# EAGLE design minicommand-sram (EAGLE 5.06)

## Sheet 1 of 5
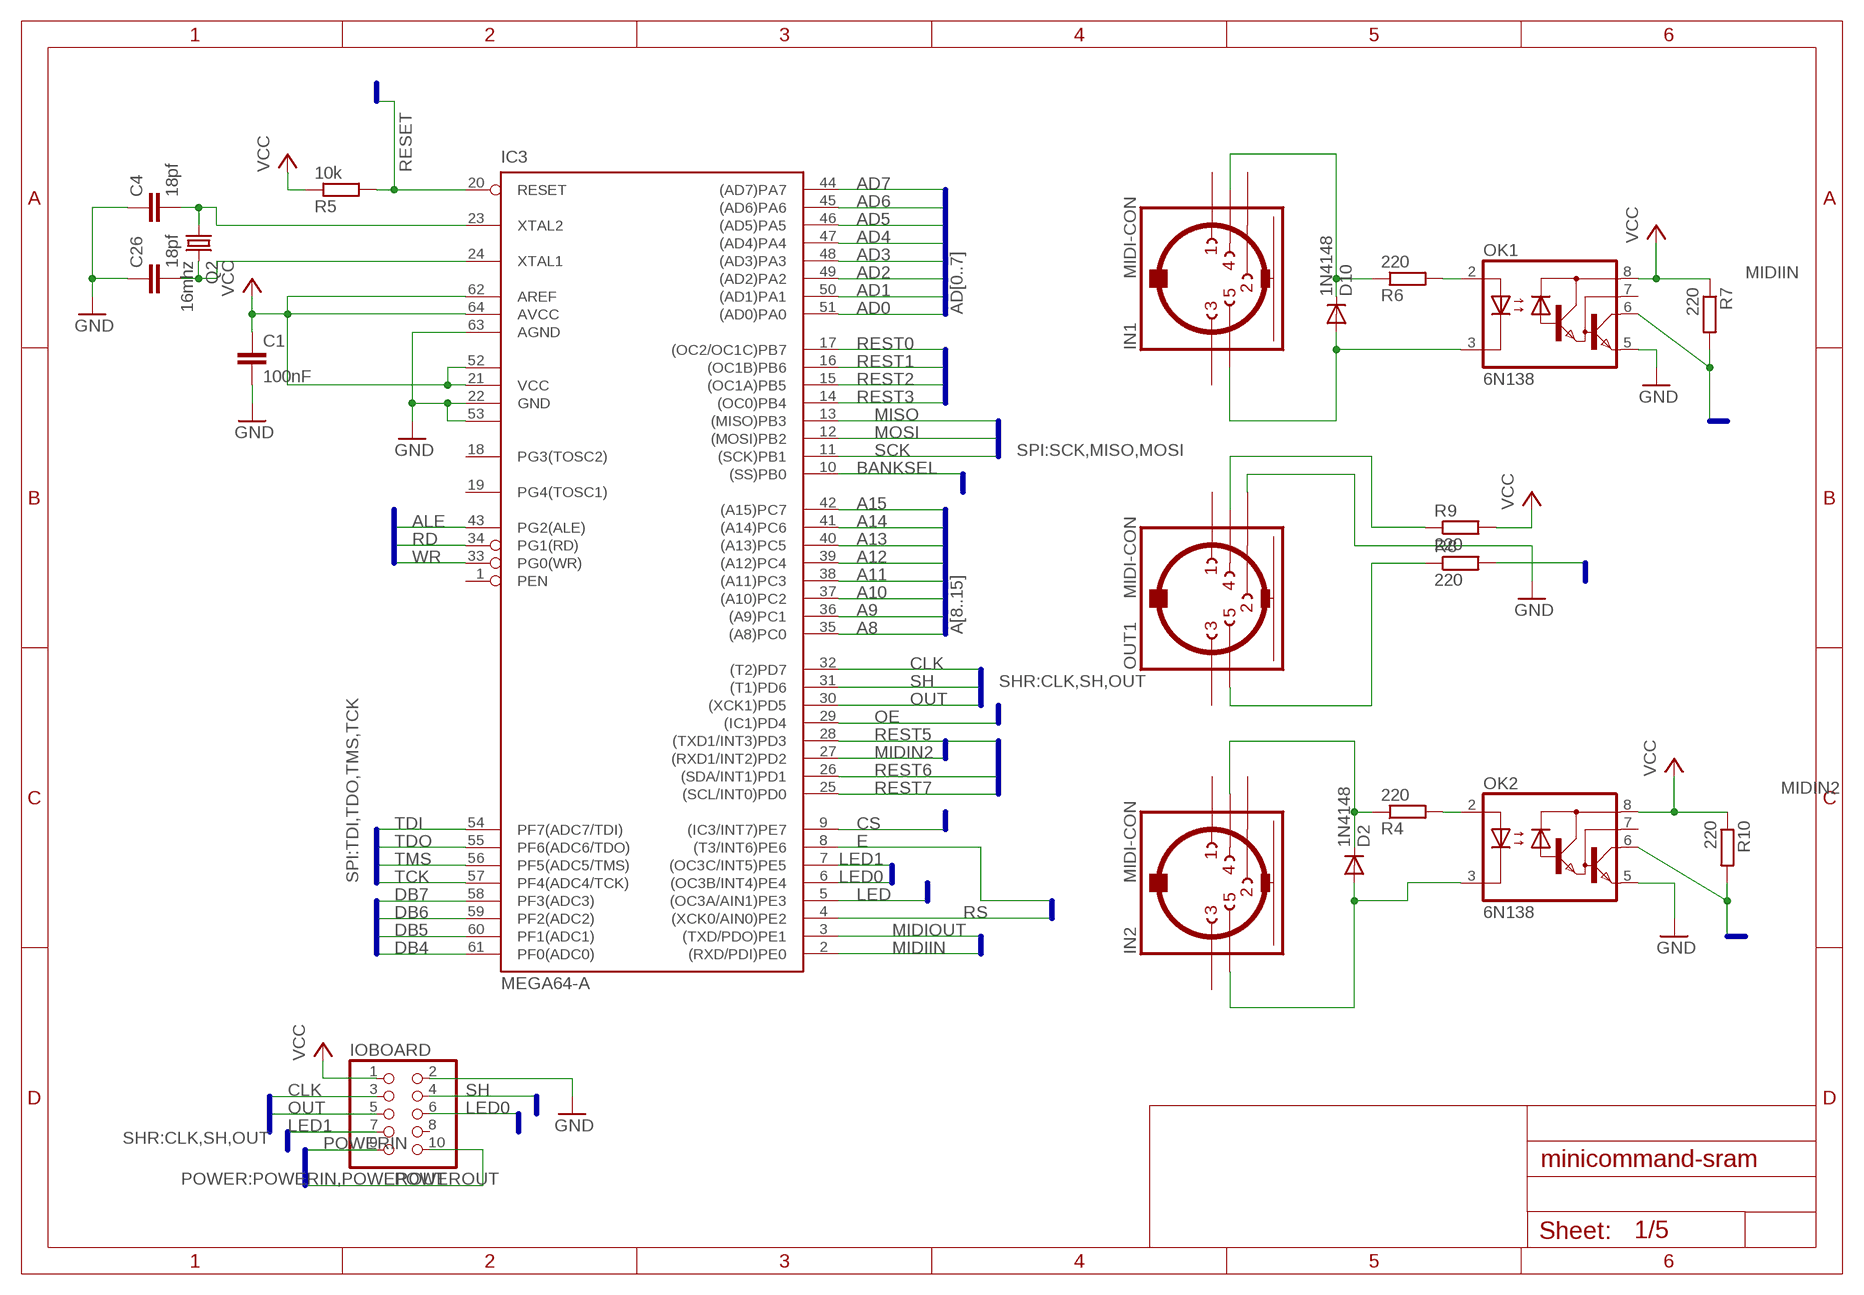
[diagram p0: schematic, sheet 1]

### Parts
C1  100nF  C-EUC0805  [C0805]
C4  18pf  C-EUC0805  [C0805]
C26  18pf  C-EUC0805  [C0805]
D2  1N4148  [DO35-10]
D10  1N4148  [DO35-10]
IC3  MEGA64-A  [TQFP64]
IN1  MIDI-CON  [MAB5S]
IN2  MIDI-CON  [MAB5S]
IOBOARD  PINHD-2X5  [2X05]
OK1  6N138  [DIL08]
OK2  6N138  [DIL08]
OUT1  MIDI-CON  [MAB5S]
Q2  16mhz  CRYSTALHC18U-V  [HC18U-V]
R4  220  R-EU_R0805  [R0805]
R5  10k  R-EU_R0805  [R0805]
R6  220  R-EU_R0805  [R0805]
R7  220  R-EU_R0805  [R0805]
R8  220  R-EU_R0805  [R0805]
R9  220  R-EU_R0805  [R0805]
R10  220  R-EU_R0805  [R0805]

### Nets
A8: IC3.35((A8)PC0) ; also sheet 4
A9: IC3.36((A9)PC1) ; also sheet 4
A10: IC3.37((A10)PC2) ; also sheet 4
A11: IC3.38((A11)PC3) ; also sheet 4
A12: IC3.39((A12)PC4) ; also sheet 4
A13: IC3.40((A13)PC5) ; also sheet 4
A14: IC3.41((A14)PC6) ; also sheet 4
A15: IC3.42((A15)PC7) ; also sheet 4
AD0: IC3.51((AD0)PA0) ; also sheet 4
AD1: IC3.50((AD1)PA1) ; also sheet 4
AD2: IC3.49((AD2)PA2) ; also sheet 4
AD3: IC3.48((AD3)PA3) ; also sheet 4
AD4: IC3.47((AD4)PA4) ; also sheet 4
AD5: IC3.46((AD5)PA5) ; also sheet 4
AD6: IC3.45((AD6)PA6) ; also sheet 4
AD7: IC3.44((AD7)PA7) ; also sheet 4
ALE: IC3.43(PG2(ALE)) ; also sheet 4
BANKSEL: IC3.10((SS)PB0) ; also sheet 4
CLK: IC3.32((T2)PD7) IOBOARD.3
CS: IC3.9((IC3/INT7)PE7) ; also sheet 5
DB4: IC3.61(PF0(ADC0)) ; also sheet 3
DB5: IC3.60(PF1(ADC1)) ; also sheet 3
DB6: IC3.59(PF2(ADC2)) ; also sheet 3
DB7: IC3.58(PF3(ADC3)) ; also sheet 3
E: IC3.8((T3/INT6)PE6) ; also sheet 3
GND: C1.2 C4.1 C26.1 IC3.22(GND) IC3.53(GND1) IC3.63(AGND) IOBOARD.2 OK1.5(GND) OK2.5(GND) OUT1.2 ; also sheet 2,3,4,5
LED: IC3.5((OC3A/AIN1)PE3) ; also sheet 3
LED0: IC3.6((OC3B/INT4)PE4) IOBOARD.6
LED1: IC3.7((OC3C/INT5)PE5) IOBOARD.7
MIDIIN: IC3.2((RXD/PDI)PE0) OK1.6(VO) R7.2
MIDIN2: IC3.27((RXD1/INT2)PD2) OK2.6(VO) R10.2
MIDIOUT: IC3.3((TXD/PDO)PE1) R8.2
MISO: IC3.13((MISO)PB3) ; also sheet 5
MOSI: IC3.12((MOSI)PB2) ; also sheet 5
N$1: D2.C IN2.4 R4.1
N$4: OK2.2(A) R4.2
N$6: D2.A IN2.5 OK2.3(C)
N$10: D10.C IN1.4 R6.1
N$11: OUT1.4 R9.1
N$12: OUT1.5 R8.1
N$13: OK1.2(A) R6.2
N$20: D10.A IN1.5 OK1.3(C)
N$27: C4.2 IC3.23(XTAL2) Q2.1
N$28: C26.2 IC3.24(XTAL1) Q2.2
OE: IC3.29((IC1)PD4) ; also sheet 5
OUT: IC3.30((XCK1)PD5) IOBOARD.5
POWERIN: IOBOARD.9 ; also sheet 2
POWEROUT: IOBOARD.10 ; also sheet 2
RD: IC3.34(PG1(RD)) ; also sheet 4
RESET: IC3.20(RESET) R5.2 ; also sheet 5
REST0: IC3.17((OC2/OC1C)PB7) ; also sheet 5
REST1: IC3.16((OC1B)PB6) ; also sheet 5
REST2: IC3.15((OC1A)PB5) ; also sheet 5
REST3: IC3.14((OC0)PB4) ; also sheet 5
REST5: IC3.28((TXD1/INT3)PD3) ; also sheet 5
REST6: IC3.26((SDA/INT1)PD1) ; also sheet 5
REST7: IC3.25((SCL/INT0)PD0) ; also sheet 5
RS: IC3.4((XCK0/AIN0)PE2) ; also sheet 3
SCK: IC3.11((SCK)PB1) ; also sheet 5
SH: IC3.31((T1)PD6) IOBOARD.4
TCK: IC3.57(PF4(ADC4/TCK)) ; also sheet 5
TDI: IC3.54(PF7(ADC7/TDI)) ; also sheet 5
TDO: IC3.55(PF6(ADC6/TDO)) ; also sheet 5
TMS: IC3.56(PF5(ADC5/TMS)) ; also sheet 5
VCC: C1.1 IC3.21(VCC) IC3.52(VCC1) IC3.62(AREF) IC3.64(AVCC) IOBOARD.1 OK1.8(VCC) OK2.8(VCC) R5.1 R7.1 R9.2 R10.1 ; also sheet 2,3,4,5
WR: IC3.33(PG0(WR)) ; also sheet 4
Unconnected: IC3.1(PEN) IC3.18(PG3(TOSC2)) IC3.19(PG4(TOSC1)) IN1.1 IN1.2 IN1.3 IN2.1 IN2.2 IN2.3 IOBOARD.8 OK1.7(VB) OK2.7(VB) OUT1.1 OUT1.3

### Buses
MIDIN2
SPI:SCK,MISO,MOSI
SHR:CLK,SH,OUT
LCD:RS,E,DB[0..7],LED
LED[0..1]
POWER:POWERIN,POWEROUT
MIDIIN,MIDIOUT
AD[0..7]
RAM:ALE,RD,WR
A[8..15]
SPI:TDI,TDO,TMS,TCK
RESET
BANKSEL
REST[0..7]
CS
OE

## Sheet 2 of 5
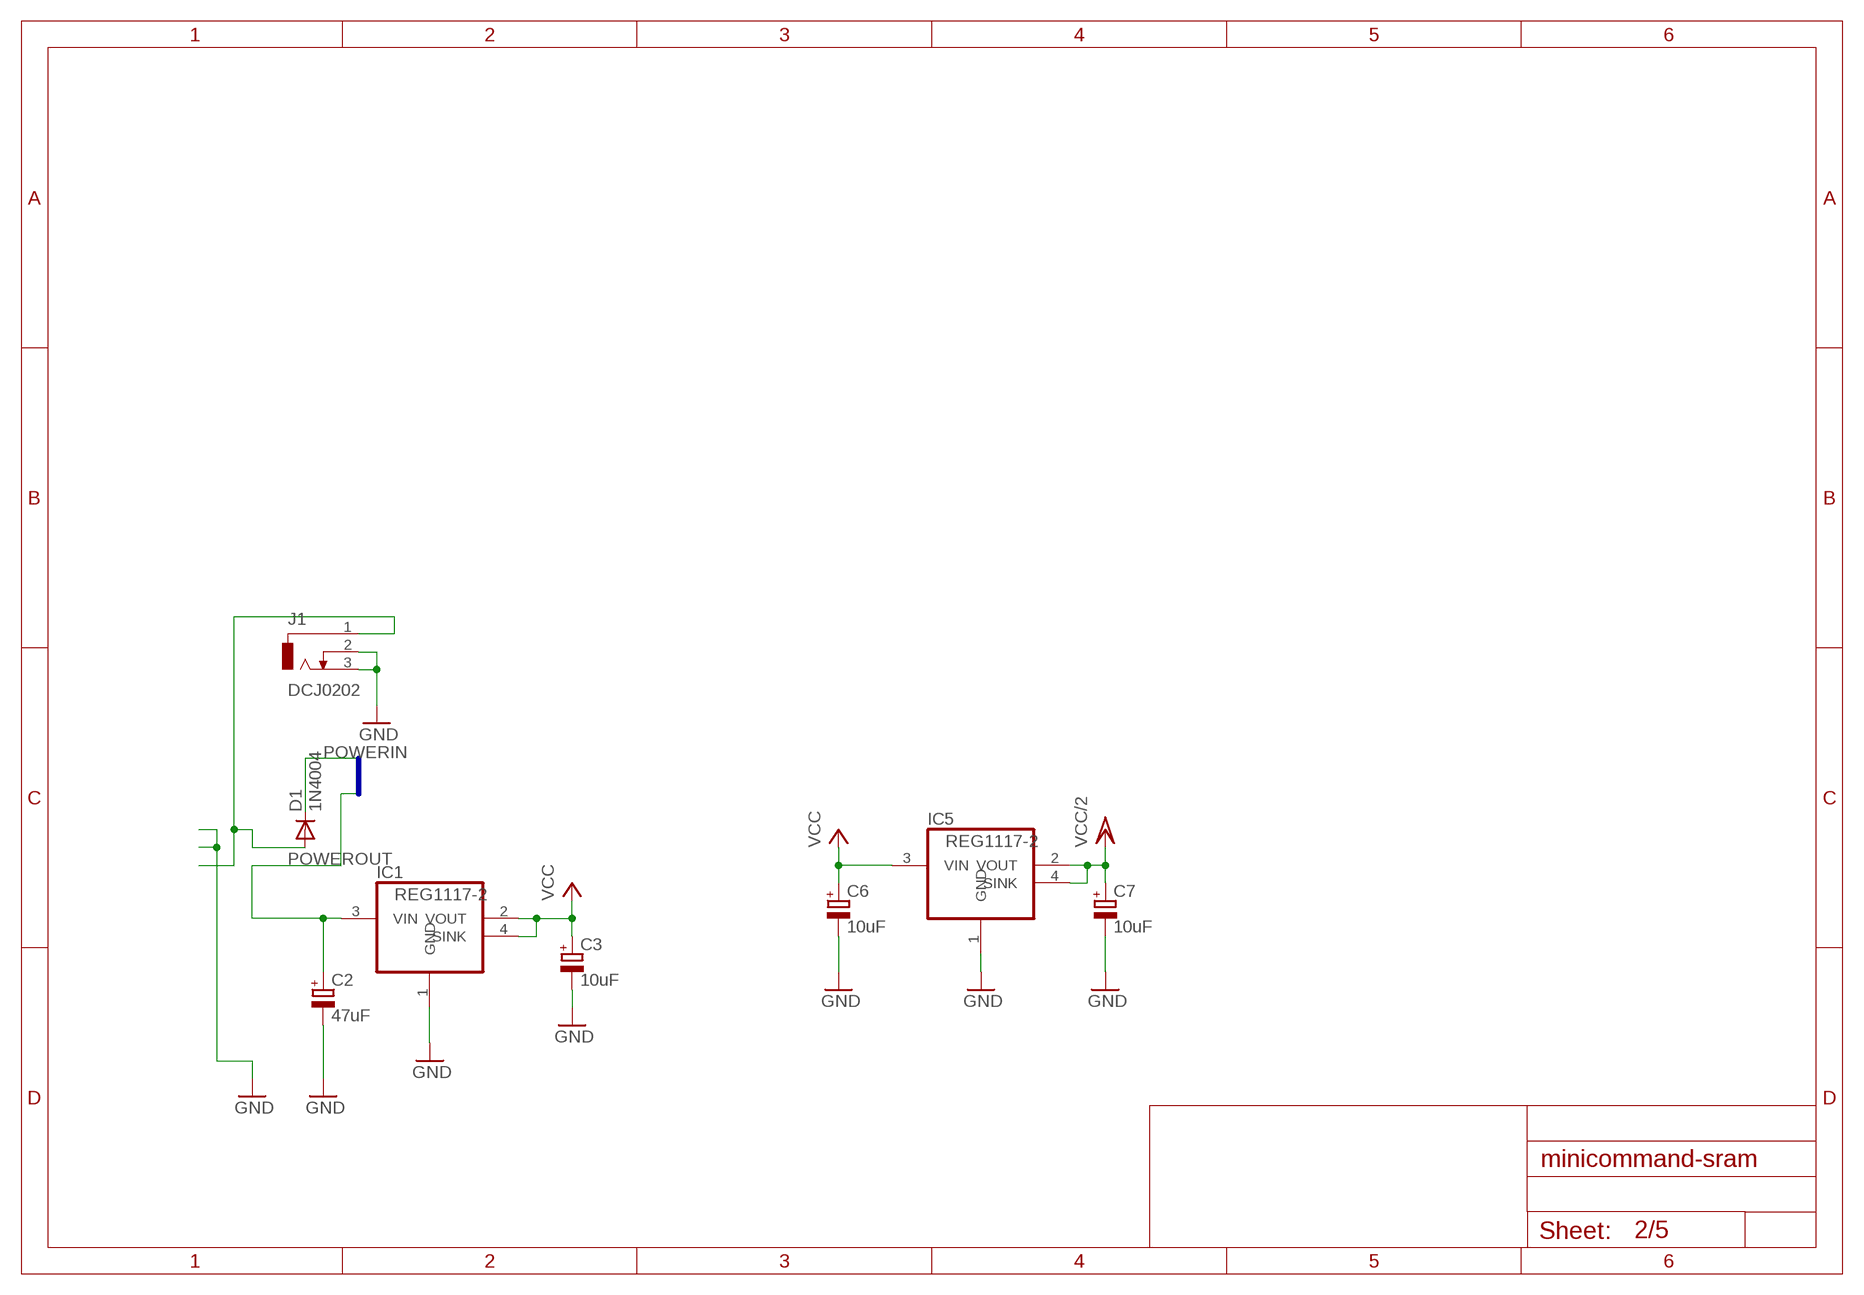
[diagram p1: schematic, sheet 2]

### Parts
C2  47uF  CPOL-EUUD-6,3X7,7  [UD-6,3X7,7_NICHICON]
C3  10uF  CPOL-EUUD-5X5,8  [UD-5X5,8_NICHICON]
C6  10uF  CPOL-EUUD-5X5,8  [UD-5X5,8_NICHICON]
C7  10uF  CPOL-EUUD-5X5,8  [UD-5X5,8_NICHICON]
D1  1N4004  [DO41-10]
IC1  REG1117-2  [SOT223]
IC5  REG1117-2  [SOT223]
J1  DCJ0202  [DCJ0202]

### Nets
GND: C2.- C3.- C6.- C7.- IC1.1(GND) IC5.1(GND) J1.2 J1.3 ; also sheet 1,3,4,5
N$9: D1.A J1.1
POWERIN: D1.C ; also sheet 1
POWEROUT: C2.+ IC1.3(VIN) ; also sheet 1
VCC: C3.+ C6.+ IC1.2(VOUT) IC1.4(SINK) IC5.3(VIN) ; also sheet 1,3,4,5
VCC/2: C7.+ IC5.2(VOUT) IC5.4(SINK) ; also sheet 5

### Buses
POWER:POWERIN,POWEROUT

## Sheet 3 of 5
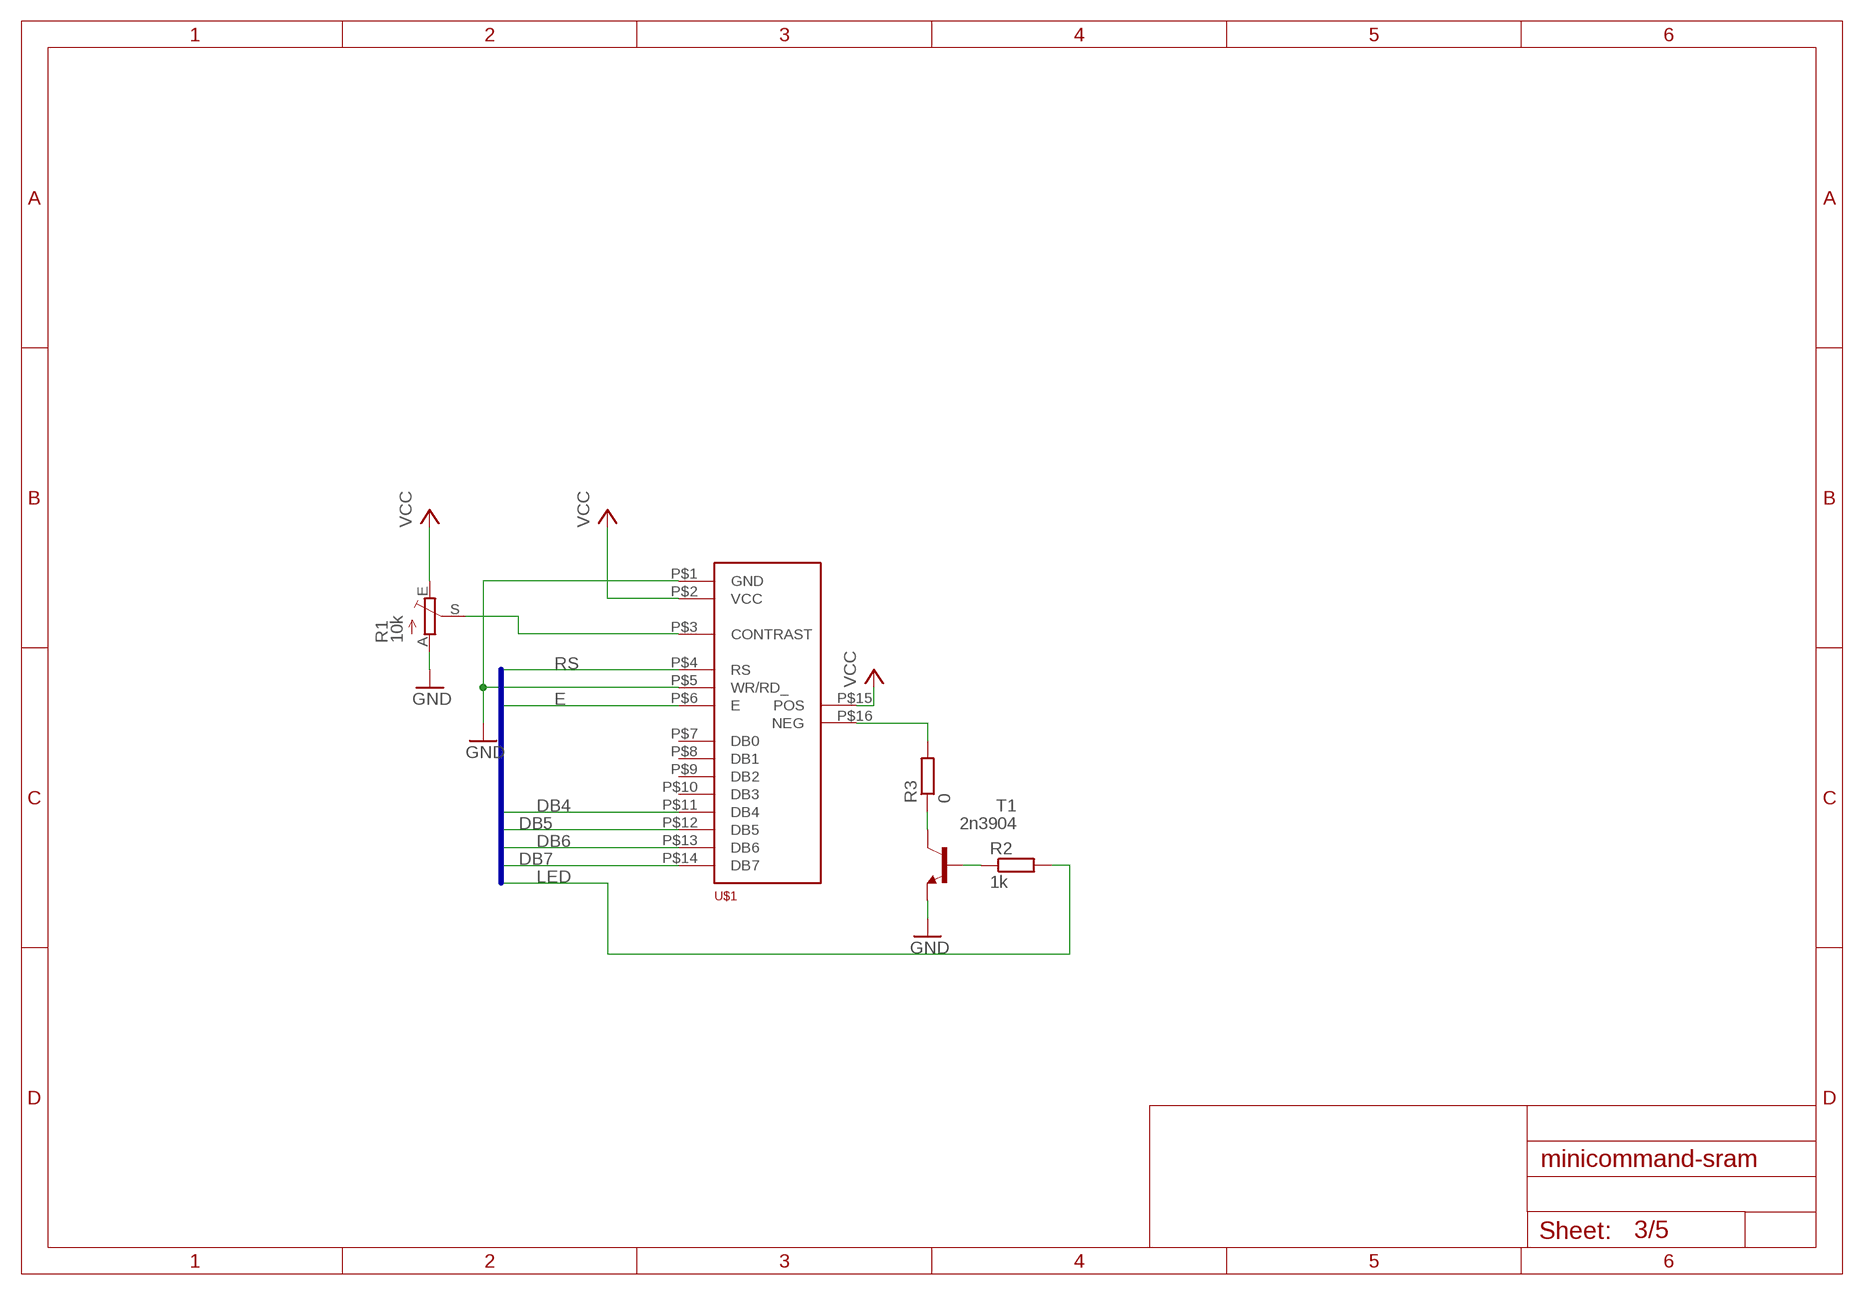
[diagram p2: schematic, sheet 3]

### Parts
R1  10k  TRIM_EU-CA6V  [CA6V]
R2  1k  R-EU_R0805  [R0805]
R3  0  R-EU_R0805  [R0805]
T1  2n3904  MMBT3904LT1-NPN-SOT23-BEC  [SOT23-BEC]
U$1  DISPLAY-C1624A  [DISPLAY-TEXT-C1624A]

### Nets
DB4: U$1.P$11(DB4) ; also sheet 1
DB5: U$1.P$12(DB5) ; also sheet 1
DB6: U$1.P$13(DB6) ; also sheet 1
DB7: U$1.P$14(DB7) ; also sheet 1
E: U$1.P$6(E) ; also sheet 1
GND: R1.A T1.E U$1.P$1(GND) U$1.P$5(WR/RD_) ; also sheet 1,2,4,5
LED: R2.2 ; also sheet 1
N$2: R1.S U$1.P$3(CONTRAST)
N$5: R3.1 T1.C
N$7: R2.1 T1.B
N$8: R3.2 U$1.P$16(NEG)
RS: U$1.P$4(RS) ; also sheet 1
VCC: R1.E U$1.P$2(VCC) U$1.P$15(POS) ; also sheet 1,2,4,5
Unconnected: U$1.P$7(DB0) U$1.P$8(DB1) U$1.P$9(DB2) U$1.P$10(DB3)

### Buses
LCD:RS,E,DB[0..7],LED

## Sheet 4 of 5
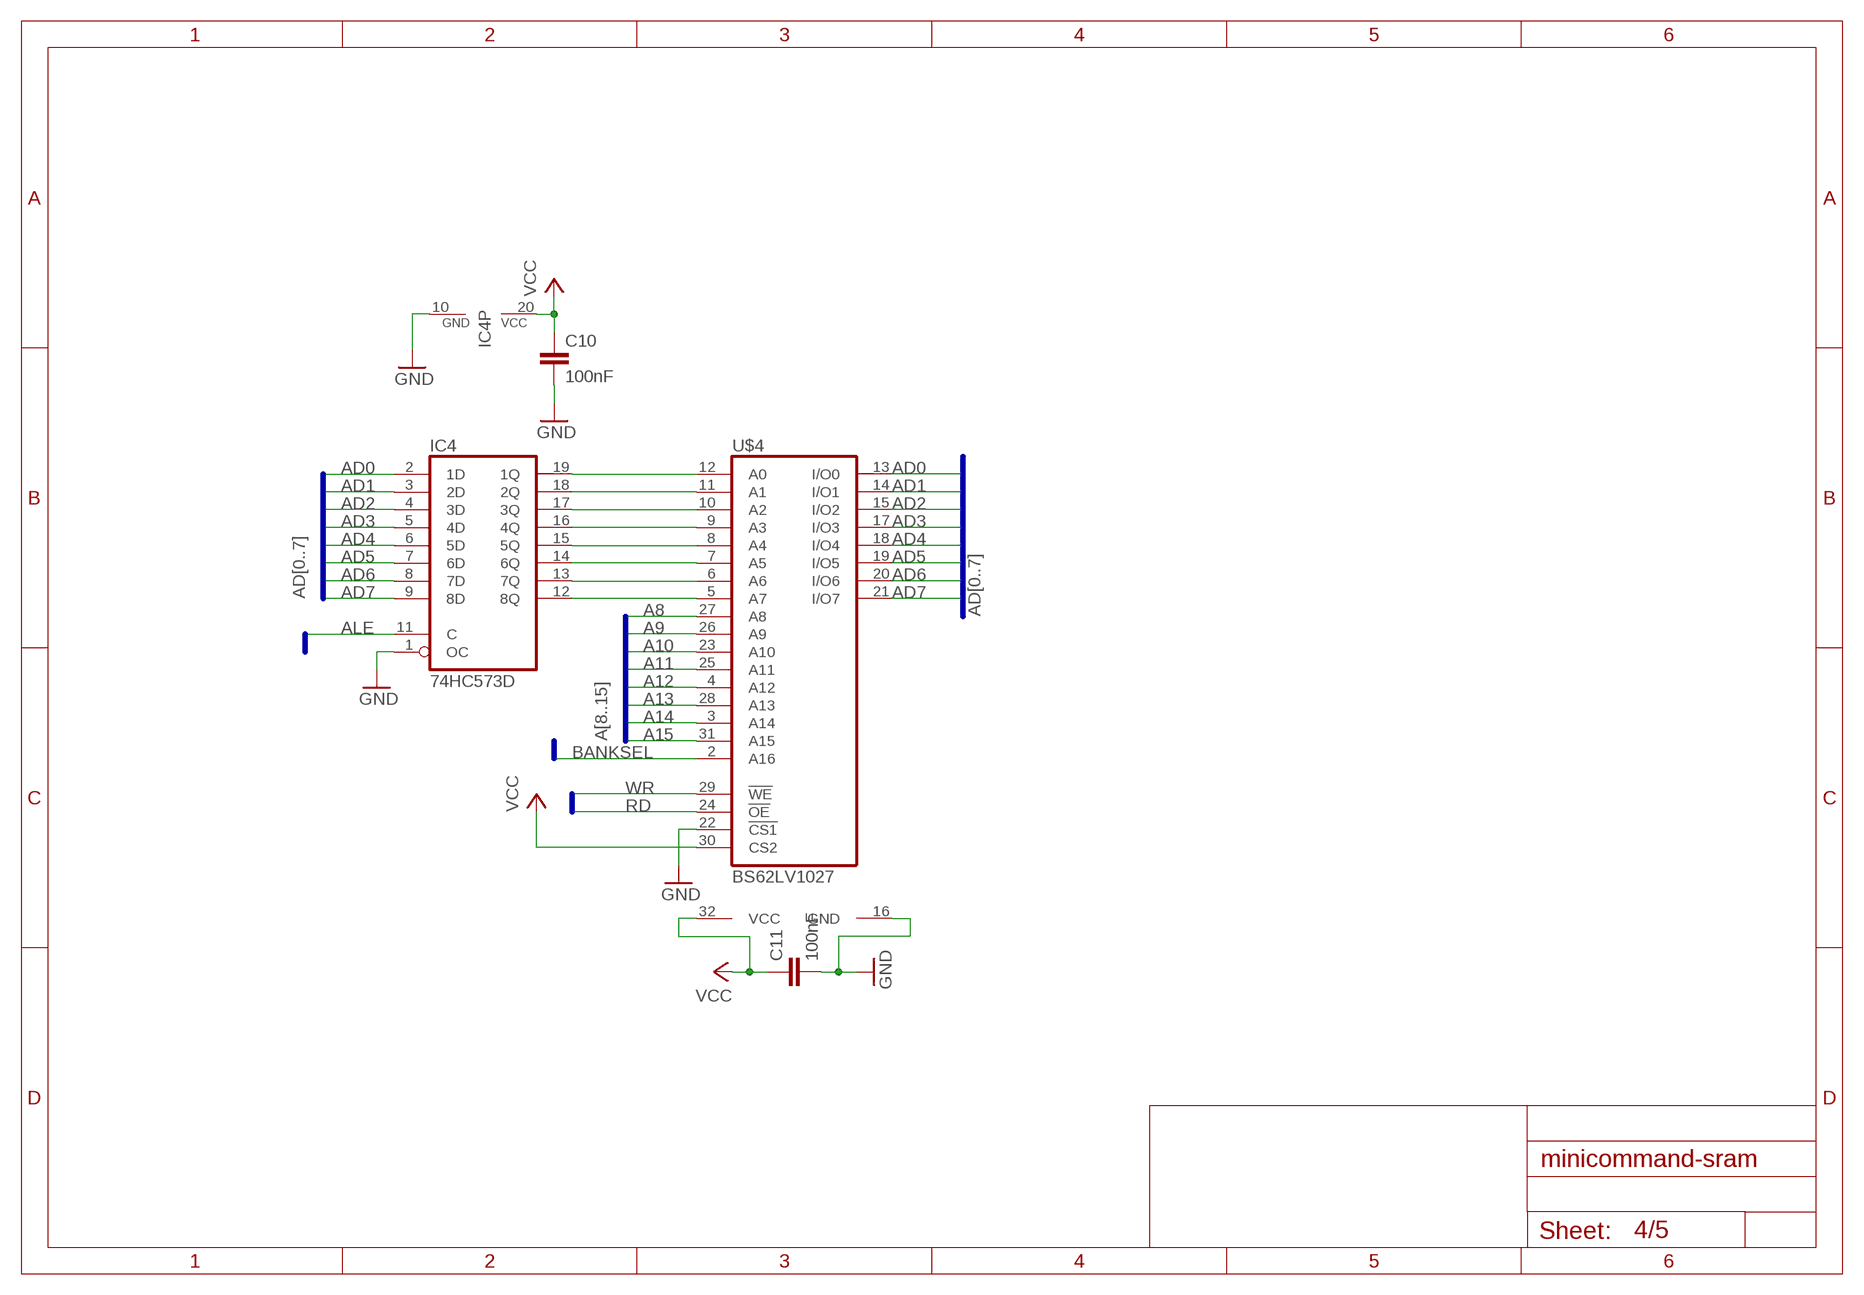
[diagram p3: schematic, sheet 4]

### Parts
C10  100nF  C-EUC0805  [C0805]
C11  100nF  C-EUC0805  [C0805]
IC4  74HC573D  [SO20W]
U$4  BS62LV1027  [SOP32]

### Nets
A0: IC4.19(1Q) U$4.12(A0)
A1: IC4.18(2Q) U$4.11(A1)
A2: IC4.17(3Q) U$4.10(A2)
A3: IC4.16(4Q) U$4.9(A3)
A4: IC4.15(5Q) U$4.8(A4)
A5: IC4.14(6Q) U$4.7(A5)
A6: IC4.13(7Q) U$4.6(A6)
A7: IC4.12(8Q) U$4.5(A7)
A8: U$4.27(A8) ; also sheet 1
A9: U$4.26(A9) ; also sheet 1
A10: U$4.23(A10) ; also sheet 1
A11: U$4.25(A11) ; also sheet 1
A12: U$4.4(A12) ; also sheet 1
A13: U$4.28(A13) ; also sheet 1
A14: U$4.3(A14) ; also sheet 1
A15: U$4.31(A15) ; also sheet 1
AD0: IC4.2(1D) U$4.13(I/O0) ; also sheet 1
AD1: IC4.3(2D) U$4.14(I/O1) ; also sheet 1
AD2: IC4.4(3D) U$4.15(I/O2) ; also sheet 1
AD3: IC4.5(4D) U$4.17(I/O3) ; also sheet 1
AD4: IC4.6(5D) U$4.18(I/O4) ; also sheet 1
AD5: IC4.7(6D) U$4.19(I/O5) ; also sheet 1
AD6: IC4.8(7D) U$4.20(I/O6) ; also sheet 1
AD7: IC4.9(8D) U$4.21(I/O7) ; also sheet 1
ALE: IC4.11(C) ; also sheet 1
BANKSEL: U$4.2(A16) ; also sheet 1
GND: C10.2 C11.2 IC4.1(OC) IC4.10(GND) U$4.16(GND) U$4.22(!CS1) ; also sheet 1,2,3,5
RD: U$4.24(!OE) ; also sheet 1
VCC: C10.1 C11.1 IC4.20(VCC) U$4.30(CS2) U$4.32(VCC) ; also sheet 1,2,3,5
WR: U$4.29(!WE) ; also sheet 1
Unconnected: U$4.1(NC)

### Buses
AD[0..7]
A[8..15]
RAM:ALE,RD,WR
BANKSEL

## Sheet 5 of 5
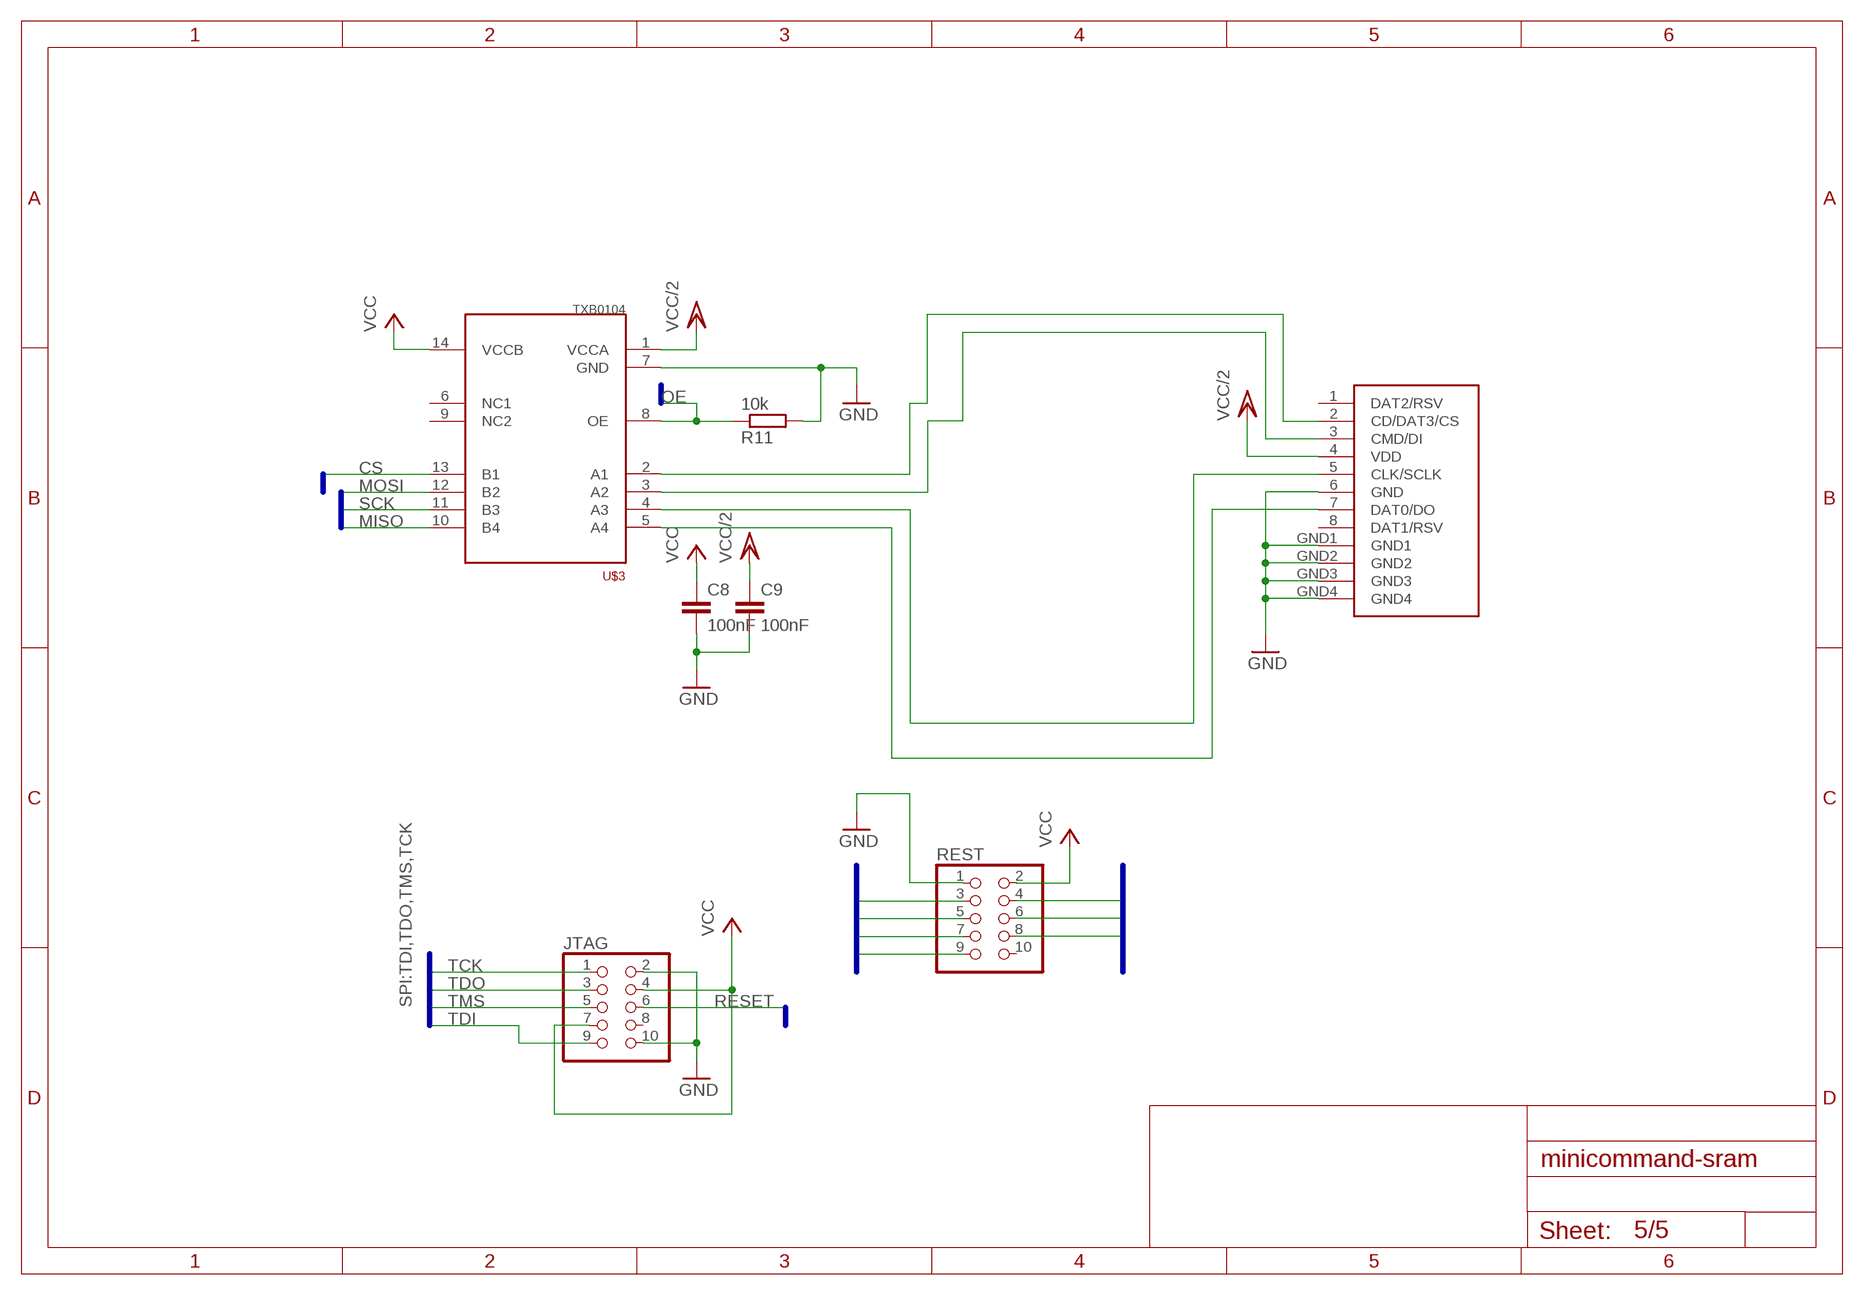
[diagram p4: schematic, sheet 5]

### Parts
C8  100nF  C-EUC0805  [C0805]
C9  100nF  C-EUC0805  [C0805]
JTAG  PINHD-2X5  [2X05]
R11  10k  R-EU_R0805  [R0805]
REST  PINHD-2X5  [2X05]
U$3  TXB0104D  [SOIC14]
U$5  MICROSD-JAE-ST1W008S4A  [ST1W008S4A]

### Nets
CS: U$3.13(B1) ; also sheet 1
GND: C8.2 C9.2 JTAG.2 JTAG.10 R11.2 REST.1 U$3.7(GND) U$5.6(GND) U$5.GND1 U$5.GND2 U$5.GND3 U$5.GND4 ; also sheet 1,2,3,4
MISO: U$3.10(B4) ; also sheet 1
MOSI: U$3.12(B2) ; also sheet 1
N$22: U$3.2(A1) U$5.2(CD/DAT3/CS)
N$23: U$3.3(A2) U$5.3(CMD/DI)
N$24: U$3.4(A3) U$5.5(CLK/SCLK)
N$25: U$3.5(A4) U$5.7(DAT0/DO)
OE: R11.1 U$3.8(OE) ; also sheet 1
RESET: JTAG.6 ; also sheet 1
REST0: REST.3 ; also sheet 1
REST1: REST.4 ; also sheet 1
REST2: REST.5 ; also sheet 1
REST3: REST.6 ; also sheet 1
REST5: REST.7 ; also sheet 1
REST6: REST.8 ; also sheet 1
REST7: REST.9 ; also sheet 1
SCK: U$3.11(B3) ; also sheet 1
TCK: JTAG.1 ; also sheet 1
TDI: JTAG.9 ; also sheet 1
TDO: JTAG.3 ; also sheet 1
TMS: JTAG.5 ; also sheet 1
VCC: C8.1 JTAG.4 JTAG.7 REST.2 U$3.14(VCCB) ; also sheet 1,2,3,4
VCC/2: C9.1 U$3.1(VCCA) U$5.4(VDD) ; also sheet 2
Unconnected: JTAG.8 REST.10 U$3.6(NC1) U$3.9(NC2) U$5.1(DAT2/RSV) U$5.8(DAT1/RSV)

### Buses
SPI:SCK,MISO,MOSI
RESET
SPI:TDI,TDO,TMS,TCK
CS
OE
REST[0..7]

## Library data of the parts
C1 C4 C8-C11 C26 = rcl:C-EU: CAPACITOR, European symbol
C2 C3 C6 C7 = rcl:CPOL-EU: POLARIZED CAPACITOR, European symbol
D1 = diode:1N4004: DIODE general purpose rectifier, 1 A
D2 D10 = diode:1N4148: DIODE high speed (Philips)
IC1 IC5 = burr-brown:REG1117-2
IC3 = atmel:MEGA64: MICROCONTROLLER 64 Kbytes FLASH 4 Kbytes SRAM 2 Kbytes EEPROM DUAL USART 8-channel 10 bit ADC Source: avr.lbr
IC4 = 74xx-eu:74*573: 8-bit D latch BUS DRIVER
IN1 IN2 OUT1 = ruinwesen:MIDI-CON
IOBOARD JTAG REST = pinhead:PINHD-2X5: PIN HEADER
J1 = con-jack:DCJ0202: DC POWER JACK Source: DCJ0202.pdf
OK1 OK2 = optocoupler:6N138: MOTOROLA OPTO COUPLER
Q2 = crystal:CRYSTAL: CRYSTAL
R1 = pot:TRIM_EU-: POTENTIOMETER
R2-R11 = rcl:R-EU_: RESISTOR, European symbol
T1 = transistor-neu-to92:*-NPN-: NPN Transistror
U$1 = ruinwesen-old:DISPLAY-C1624A
U$3 = ruinwesen:TXB0104D
U$4 = ruinwesen:BS62LV1027
U$5 = ruinwesen:MICROSD-JAE-ST1W008S4A

## Board
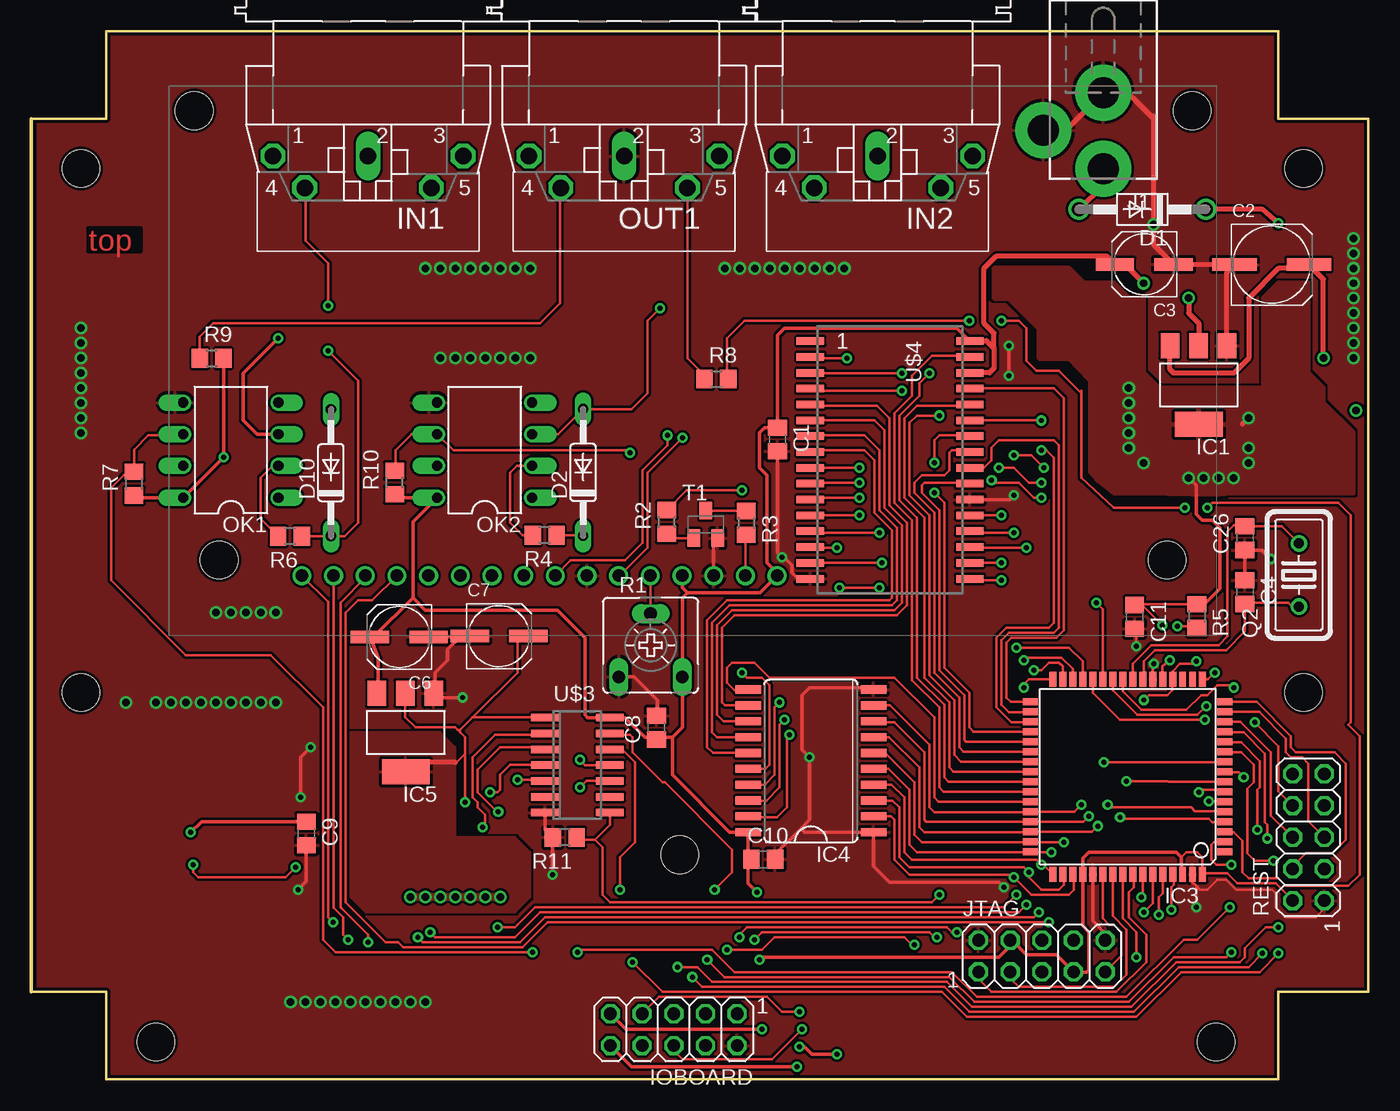
[diagram p5: board, top side]
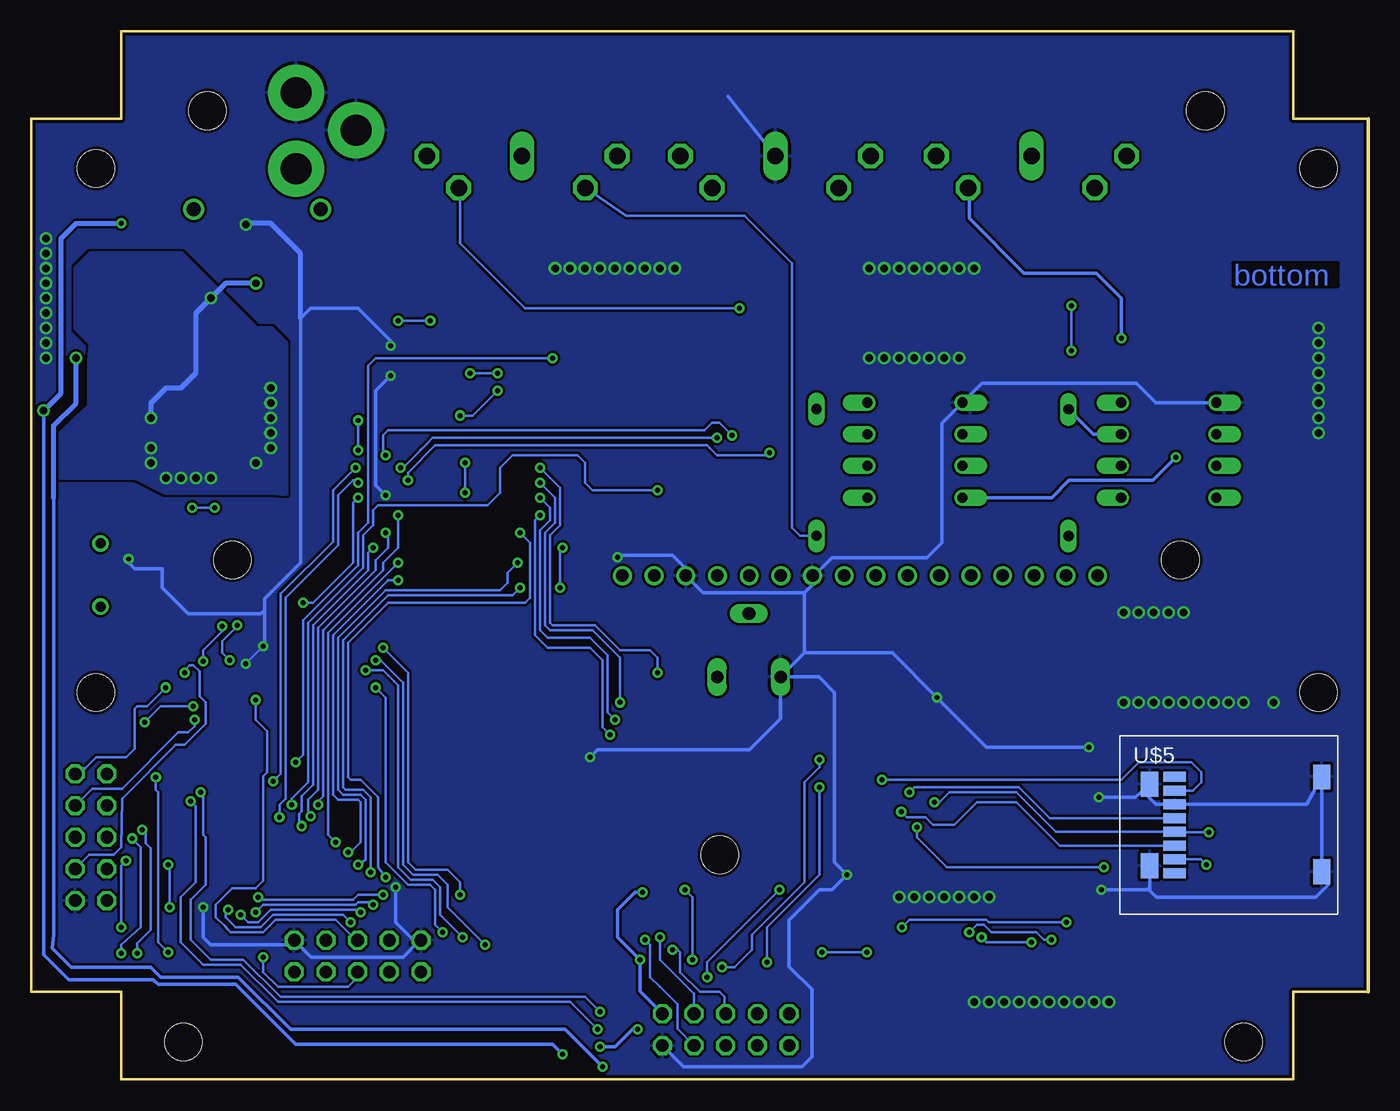
[diagram p6: board, bottom side, seen from below]

Size 107.2 x 84 mm. Coordinates in mm from the lower left corner, seen from the top.
Outline: 6,0 100,0 100,7 107.2,7 107.2,77 100,77 100,84 6,84 6,77 0,77 0,7 6,7 6,0
Copper layers (1*16): Top 0.0175mm / dielectric 1.5mm / Bottom 0.0175mm
Design rules "default *": minimum track width 0.15mm, minimum drill 0.25mm, track to track 0.2mm, track to pad 0.2mm, pad to pad 0.2mm, via to via 0.2mm, smd to smd 0.15mm, copper to edge 0.25mm, drill to drill 8mil, minimum pad ring 10mil, minimum via ring 8mil, stop-mask expansion 4mil, vias tented up to drill 0mil, thermal gap 10mil
Holes 3 mm at 10,3 4,31 95,3 102,31 52,18 102,73 4,73

### Footprints (pad centres in the part's own frame; a part is rotated, then mirrored left to right if it is on the bottom)
C0805 = smd 1.3 x 1.5: 1 -0.95,0; 2 0.95,0
UD-6,3X7,7_NICHICON = smd 3.562 x 1: + 2.985,0; - -2.985,0
UD-5X5,8_NICHICON = smd 3.062 x 1: + 2.36,0; - -2.335,0
DO41-10 = drill 1.118 round: A 5.08,0; C -5.08,0
DO35-10 = drill 0.813 long: A 5.08,0; C -5.08,0
SOT223 = smd 1.499 x 2.007: 1 -2.261,-3.15; 2 0.025,-3.15; 3 2.311,-3.15 | smd 3.81 x 2.007: 4 0,3.15
TQFP64 = smd 1.194 x 0.559: 1 -7.8,6; 2 -7.8,5.2; 3 -7.8,4.4; 4 -7.8,3.6; 5 -7.8,2.8; 6 -7.8,2; 7 -7.8,1.2; 8 -7.8,0.4; 9 -7.8,-0.4; 10 -7.8,-1.2; 11 -7.8,-2; 12 -7.8,-2.8; 13 -7.8,-3.6; 14 -7.8,-4.4; 15 -7.8,-5.2; 16 -7.8,-6; 33 7.8,-6; 34 7.8,-5.2; 35 7.8,-4.4; 36 7.8,-3.6; 37 7.8,-2.8; 38 7.8,-2; 39 7.8,-1.2; 40 7.8,-0.4; 41 7.8,0.4; 42 7.8,1.2; 43 7.8,2; 44 7.8,2.8; 45 7.8,3.6; 46 7.8,4.4; 47 7.8,5.2; 48 7.8,6 | smd 0.559 x 1.194: 17 -6,-7.8; 18 -5.2,-7.8; 19 -4.4,-7.8; 20 -3.6,-7.8; 21 -2.8,-7.8; 22 -2,-7.8; 23 -1.2,-7.8; 24 -0.4,-7.8; 25 0.4,-7.8; 26 1.2,-7.8; 27 2,-7.8; 28 2.8,-7.8; 29 3.6,-7.8; 30 4.4,-7.8; 31 5.2,-7.8; 32 6,-7.8; 49 6,7.8; 50 5.2,7.8; 51 4.4,7.8; 52 3.6,7.8; 53 2.8,7.8; 54 2,7.8; 55 1.2,7.8; 56 0.4,7.8; 57 -0.4,7.8; 58 -1.2,7.8; 59 -2,7.8; 60 -2.8,7.8; 61 -3.6,7.8; 62 -4.4,7.8; 63 -5.2,7.8; 64 -6,7.8
SO20W = smd 0.66 x 2.032: 1 -5.715,-5.029; 2 -4.445,-5.029; 3 -3.175,-5.029; 4 -1.905,-5.029; 5 -0.635,-5.029; 6 0.635,-5.029; 7 1.905,-5.029; 8 3.175,-5.029; 9 4.445,-5.029; 10 5.715,-5.029; 11 5.715,5.029; 12 4.445,5.029; 13 3.175,5.029; 14 1.905,5.029; 15 0.635,5.029; 16 -0.635,5.029; 17 -1.905,5.029; 18 -3.175,5.029; 19 -4.445,5.029; 20 -5.715,5.029
MAB5S = drill 1.321 octagon: 1 7.62,5.08; 3 -7.62,5.08; 4 5.08,7.62; 5 -5.08,7.62 | drill 1.321 long: 2 0,5.08
2X05 = drill 1.016 octagon: 1 -5.08,-1.27; 2 -5.08,1.27; 3 -2.54,-1.27; 4 -2.54,1.27; 5 0,-1.27; 6 0,1.27; 7 2.54,-1.27; 8 2.54,1.27; 9 5.08,-1.27; 10 5.08,1.27
DCJ0202 = drill 2.5 pad 4.5 round: 1 0,3.1; 2 4.8,0; 3 0,-3
DIL08 = drill 0.813 offset: 1 -3.81,-3.81; 2 -1.27,-3.81; 3 1.27,-3.81; 4 3.81,-3.81; 5 3.81,3.81; 6 1.27,3.81; 7 -1.27,3.81; 8 -3.81,3.81
HC18U-V = drill 0.813 round: 1 -2.54,0; 2 2.54,0
CA6V = drill 1.016 long: A -2.54,-2.54; E 2.54,-2.54; S 0,2.54
R0805 = smd 1.3 x 1.5: 1 -0.95,0; 2 0.95,0
SOT23-BEC = smd 1 x 1.4: B -0.95,-1.1; C 0,1.1; E 0.95,-1.1
DISPLAY-TEXT-C1624A = drill 1 round: P$1 5.08,-24.13; P$2 2.54,-24.13; P$3 0,-24.13; P$4 -2.54,-24.13; P$5 -5.08,-24.13; P$6 -7.62,-24.13; P$7 -10.16,-24.13; P$8 -12.7,-24.13; P$9 -15.24,-24.13; P$10 -17.78,-24.13; P$11 -20.32,-24.13; P$12 -22.86,-24.13; P$13 -25.4,-24.13; P$14 -27.94,-24.13; P$15 10.16,-24.13; P$16 7.62,-24.13 | hole 3: -36.57,13.12; 43.43,13.12; -34.57,-22.88; 41.43,-22.88
SOIC14 = smd 0.6 x 2.2: 1 -3.81,-2.6; 2 -2.54,-2.6; 3 -1.27,-2.6; 4 0,-2.6; 5 1.27,-2.6; 6 2.54,-2.6; 7 3.81,-2.6; 8 3.81,2.6; 9 2.54,2.6; 10 1.27,2.6; 11 0,2.6; 12 -1.27,2.6; 13 -2.54,2.6; 14 -3.81,2.6
SOP32 = smd 0.6 x 2.2: 1 -8.255,-6.4; 2 -6.985,-6.4; 3 -5.715,-6.4; 4 -4.445,-6.4; 5 -3.175,-6.4; 6 -1.905,-6.4; 7 -0.635,-6.4; 8 0.635,-6.4; 9 1.905,-6.4; 10 3.175,-6.4; 11 4.445,-6.4; 12 5.715,-6.4; 13 6.985,-6.4; 14 8.255,-6.4; 15 9.525,-6.4; 16 10.795,-6.4; 17 10.795,6.4; 18 9.525,6.4; 19 8.255,6.4; 20 6.985,6.4; 21 5.715,6.4; 22 4.445,6.4; 23 3.175,6.4; 24 1.905,6.4; 25 0.635,6.4; 26 -0.635,6.4; 27 -1.905,6.4; 28 -3.175,6.4; 29 -4.445,6.4; 30 -5.715,6.4; 31 -6.985,6.4; 32 -8.255,6.4
ST1W008S4A = smd 1.8 x 0.8: 1 -5.5,-3.3; 2 -5.5,-2.2; 3 -5.5,-1.1; 4 -5.5,0; 5 -5.5,1.1; 6 -5.5,2.2; 7 -5.5,3.3; 8 -5.5,4.4 | smd 1.4 x 2: GND1 -7.5,-2.7; GND2 -7.5,3.8; GND3 6.3,-3.2; GND4 6.3,4.4

### Placement (x,y rotation side)
C1  59.83,51.28 270 top
C2  99.45,65.29 0 top
C3  89.25,65.32 180 top
C4  97.3,39.05 270 top
C6  29.52,35.45 180 top
C7  37.5,35.52 0 top
C8  50.13,28.18 90 top
C9  22.06,19.7 270 top
C10  58.7,17.63 0 top
C11  88.47,37.06 270 top
C26  97.3,43.37 90 top
D1  89.09,69.72 180 top
D2  44.25,48.64 90 top
D10  24.03,48.62 90 top
IC1  93.61,55.65 180 top
IC3  87.91,24.25 180 top
IC4  62.51,25.52 90 top
IC5  30.02,27.79 180 top
IN1  27.01,79.07 180 top
IN2  67.85,79.07 180 top
IOBOARD  51.52,3.98 180 top
J1  85.95,76.07 180 top
JTAG  81.03,9.88 0 top
OK1  16.01,50.43 90 top
OK2  36.36,50.43 90 top
OUT1  47.53,79.07 180 top
Q2  101.63,40.42 90 top
R1  49.66,34.79 0 top
R2  50.96,44.67 90 top
R3  57.33,44.6 270 top
R4  41.16,43.6 180 top
R5  93.45,37.12 270 top
R6  20.75,43.52 180 top
R7  8.25,47.73 90 top
R8  54.94,56.13 0 top
R9  14.47,57.79 0 top
R10  29.15,47.83 90 top
R11  42.77,19.39 180 top
REST  102.4,19.4 90 top
T1  54.08,44.47 0 top
U$1  49.64,64.5 0 top
U$3  43.79,25.18 270 top
U$4  68.86,50.91 270 top
U$5  10.03,19.83 0 bottom

### Tracks (layer width: path | path; a pad name or v marks a point on that pad's centre or on a via)
A0  (via drill 0.4)
  Top 0.2: IC4.19 57.56,21 59.8,21 60.6,21.8 60.6,27.4 v60.8,27.6 | v66.4,45.2 U$4.12
  Bottom 0.2: v60.8,27.6 61.4,28.2 61.4,33.6 62.4,34.6 65.8,34.6 66.8,35.6 66.8,44.8 v66.4,45.2
A1  (via drill 0.4)
  Top 0.2: IC4.18 58.95,22.34 60,23.4 60,28.4 v60.4,28.8 | v66.4,46.6 62.59,46.6 U$4.11
  Bottom 0.2: v60.4,28.8 61,29.4 61,34 62.4,35.4 65.8,35.4 66.4,36 66.4,44 65.6,44.8 65.6,45.8 v66.4,46.6
A2  (via drill 0.4)
  Top 0.2: IC4.17 58.81,23.61 59.6,24.4 59.6,29.8 v60,30.2 | v66.4,47.8 62.53,47.8 U$4.10
  Bottom 0.2: v66.4,47.8 65.2,46.6 65.2,44.6 66,43.8 66,36.4 65.6,36 62.2,36 60,33.8 v60,30.2
A3  (via drill 0.4)
  Top 0.2: IC4.16 58.88,24.89 59.2,25.2 59.2,31.6 58.6,32.2 57.4,32.2 v57,32.6 | v66.4,49 U$4.9
  Bottom 0.2: v57,32.6 57,33.8 57.6,34.4 57.8,34.4 60,34.4 62,36.4 65.4,36.4 65.6,36.6 65.6,43.6 64.8,44.4 64.8,47.4 v66.4,49
A4
  Top 0.2: IC4.15 54.65,26.16 54.2,26.6 54.2,36.8 55.8,38.4 68.8,38.4 69,38.6 69,44 67.6,45.4 67.6,49.6 66.8,50.4 62.58,50.4 U$4.8 62.53,50.2
A5
  Top 0.2: IC4.14 54.98,27.43 54.6,27.8 54.6,36.6 56,38 69,38 69.4,38.4 69.4,44.2 68,45.6 68,50.4 66.8,51.6 62.52,51.6 U$4.7
A6
  Top 0.2: IC4.13 55.51,28.7 55,29.2 55,36.4 56.2,37.6 69.2,37.6 69.8,38.2 69.8,44.4 68.4,45.8 68.4,52 67.6,52.8 62.47,52.8 U$4.6
A7
  Top 0.2: IC4.12 55.63,29.96 55.4,30.2 55.4,36.2 56.4,37.2 69.4,37.2 70.2,38 70.2,44.6 68.8,46 68.8,53 67.8,54 62.55,54 U$4.5 62.58,54.2
A8  (via drill 0.4)
  Top 0.2: IC3.35 80.06,28.6 78.6,28.6 77.4,29.8 77.4,35.4 78.2,36.2 81.6,36.2 82,36.6 82,49.8 81.4,50.4 v81,50.4 | v81,52.8 75.28,52.8 U$4.27
  Bottom 0.2: v81,50.4 v81,52.8
A9  (via drill 0.4)
  Top 0.2: IC3.36 75.55,27.85 75.2,28.2 75.2,31 73.2,33 73.2,46.2 v72.4,47 | U$4.26 75.2,51.6 72.8,51.6 72.4,51.2 v72.4,49.4
  Bottom 0.2: v72.4,47 v72.4,49.4
A10
  Top 0.2: IC3.37 74.95,27.05 74.8,27.2 74.8,30.8 72.8,32.8 72.8,45.6 71.4,47 71.4,47.6 71.6,47.8 74,47.8 | 74,47.8 73.2,47.8 | 74,47.8 75.19,47.8 U$4.23
A11
  Top 0.2: IC3.38 74.75,26.25 74.4,26.6 74.4,30.6 72.4,32.6 72.4,45.4 70.8,47 70.8,47.8 71.4,48.4 73.2,48.4 73.6,48.8 73.6,50.2 73.8,50.4 75.14,50.4 U$4.25
A12  (via drill 0.4)
  Top 0.2: IC3.39 74.55,25.45 74,26 74,30.4 72,32.4 72,45.2 70.4,46.8 70.4,52.6 71,53.2 v72.8,53.2 72.6,53 | v69.8,55.2 62.61,55.2 U$4.4
  Bottom 0.2: v72.8,53.2 71.8,53.2 v69.8,55.2
A13
  Top 0.2: IC3.40 73.95,24.65 73.6,25 73.6,30.2 71.6,32.2 71.6,45 70,46.6 70,53 71,54 72.2,54 75.17,54 U$4.28
A14  (via drill 0.4)
  Top 0.2: IC3.41 73.55,23.85 73.2,24.2 73.2,30 71,32.2 71,45 69.6,46.4 69.6,53.2 71.2,54.8 71.2,55.8 v72,56.6 | v69.8,56.6 62.48,56.6 U$4.3
  Bottom 0.2: v72,56.6 v69.8,56.6
A15
  Top 0.2: IC3.42 73.15,23.05 72.8,23.4 72.8,29.8 70.6,32 70.6,44.8 69.2,46.2 69.2,53.4 70.6,54.8 70.6,56.4 72.2,58 75.16,58 U$4.31
AD0  (via drill 0.4)
  Top 0.2: IC4.2 68.92,21.07 69.2,20.8 69.2,17.6 70.4,16.4 78.6,16.4 v78.8,16.2 80.2,14.8 83.2,14.8 83.6,15.2 83.6,16.36 IC3.51 | v68,43.8 62.58,43.8 U$4.13
  Bottom 0.2: v78.8,16.2 79.4,17 79.4,22.6 80.8,24 81.6,24 81.8,24.2 81.8,30.4 81.8,35 78.6,38.2 67.6,38.2 67.2,38.6 67.2,43 v68,43.8
AD1  (via drill 0.4)
  Top 0.2: IC4.3 69.06,22.34 69.6,21.8 69.6,17.8 70.4,17 79.6,17 v80,16.6 80,16.2 81,15.2 82.4,15.2 82.8,15.6 82.8,16.36 IC3.50 82.8,16.54 | v68,39.4 v64.8,39.4 | v64.6,42.6 62.52,42.6 U$4.14
  Bottom 0.2: v80,16.6 80,22.6 80.6,23.2 82,23.2 82.2,23.4 82.2,31.2 82.2,35.2 78.6,38.8 68.6,38.8 v68,39.4 | v64.8,39.4 64.8,42.4 v64.6,42.6
AD2  (via drill 0.4)
  Top 0.2: IC4.4 68.98,23.61 70,22.6 70,18.2 70.6,17.6 80.6,17.6 v81,17.2 81.16,17.2 IC3.49 82,16.36 82,16 | v68.2,41.4 62.47,41.4 U$4.15
  Bottom 0.2: v81,17.2 80.4,17.6 80.4,22.4 80.8,22.8 82.2,22.8 82.6,23.2 82.6,32 82.6,35.4 78.8,39.2 69.6,39.2 69,39.8 69,40.6 v68.2,41.4 68,41.2
AD3  (via drill 0.4)
  Top 0.2: IC4.5 68.72,24.89 70.4,23.2 70.4,18.8 71,18.2 80.06,18.2 IC3.48 | IC3.48 80.2,18.16 | v81.8,18.2 80.16,18.2 IC3.48 | v77.8,40 75.38,40 U$4.17
  Bottom 0.2: v81.8,18.2 81.6,18.2 80.8,19 80.8,22.2 81,22.4 82.6,22.4 83,22.8 83,32.2 83,35.6 78.6,40 v77.8,40
AD4  (via drill 0.4)
  Top 0.2: IC4.6 68.44,26.16 70.8,23.8 70.8,19.6 71.4,19 80.06,19 IC3.47 80.16,19 v82.8,19 | v77.8,41.4 75.28,41.4 U$4.18
  Bottom 0.2: v77.8,41.4 83.4,35.8 83.4,33.2 83.4,19.6 v82.8,19
AD5  (via drill 0.4)
  Top 0.2: IC4.7 68.78,27.43 71.2,25 71.2,20.2 71.6,19.8 80.06,19.8 IC3.46 | IC3.46 80.16,19.8 | v79.8,42.6 75.31,42.6 U$4.19 | IC3.46 85.05,19.85 v85.5,20.3
  Bottom 0.2: v79.8,42.6 80.2,42.2 80.2,40.8 84.6,36.4 84.6,23.6 85.5,22.7 85.5,21.5 85.7,21.3 85.7,20.5 v85.5,20.3
AD6  (via drill 0.4)
  Top 0.2: IC3.45 71.75,20.65 71.6,20.8 71.6,26.2 69.2,28.6 67.2,28.6 67,28.8 67.43,28.8 IC4.8 | IC3.45 80.16,20.6 | v78.8,43.8 75.39,43.8 U$4.20 | IC3.45 84.35,20.65 v84.8,21.1
  Bottom 0.2: 84.2,33.8 84.2,33.6 | 84.2,33.8 84.2,36.2 79.6,40.8 79.6,41.6 78.6,42.6 78.6,43.6 v78.8,43.8 | v84.8,21.1 85,21.3 85,22.4 84.2,23.2 84.2,33.8
AD7  (via drill 0.4)
  Top 0.2: IC4.9 68.83,29.96 72,26.8 72,21.8 72.4,21.4 80.06,21.4 IC3.44 | IC3.44 80.16,21.4 | v77.8,45.2 U$4.21 | IC3.44 83.65,21.45 v84.2,22
  Bottom 0.2: v77.8,45.2 77.8,42.6 79,41.4 79,40.8 83.8,36 83.8,22.7 84.2,22.3 v84.2,22
ALE
  Top 0.2: IC3.43 72.75,22.25 72.4,22.6 72.4,29 69.2,32.2 59.2,32.2 58,33.4 56.2,33.4 55.8,33 55.8,31.8 56.4,31.2 57.45,31.2 IC4.11
BANKSEL  (via drill 0.4)
  Top 0.2: v65.4,57.8 62.56,57.8 U$4.2 | IC3.10 95.66,25.4 89.6,25.4 v86,25.4
  Bottom 0.2: v65.4,57.8 79.6,57.8 80.2,57.2 80.2,44.6 81,43.8 81,41.2 85.4,36.8 85.4,26 v86,25.4
CLK  (via drill 0.4)
  Top 0.2: IC3.32 80,32.05 79.6,31.65 v79.6,31.4 | v74.2,11.8 73.8,11.8 73.4,12.2 57.4,12.2 56.8,11.6 v56.8,11.4
  Bottom 0.2: v79.6,31.4 78.8,30.6 78.8,17.4 77,15.6 75.2,15.6 74.8,15.2 74.8,12.4 v74.2,11.8 | IOBOARD.3 54.06,6.86 56.8,9.6 v56.8,11.4
CS  (via drill 0.4)
  Top 0.2: v96.2,10.2 95.8,9.8 91.6,9.8 88,6.2 75.6,6.2 73.6,8.2 55.6,8.2 v54.2,9.6 | U$3.13 46.51,27.6 48,27.6 48.2,27.4 48.2,26.2 50.6,23.8 50.8,23.8 56.2,18.4 56.2,16.6 v54.8,15.2 | IC3.9 95.66,24.6 96.8,24.6 v97.2,24.2
  Bottom 0.2: v96.2,10.2 97,11 97,23 97.2,23.2 v97.2,24.2 | v54.2,9.6 54.2,14.6 v54.8,15.2
DB4  (via drill 0.4)
  Top 0.2: v91.4,13.6 91.4,15.4 91.6,15.6 91.6,16.36 IC3.61 | v81.6,12.6 41.4,12.6 39.4,10.6 29.8,10.6 29.4,11 28.4,11 25.2,14.2 25.2,37.4 26.2,38.4 27.35,38.4 U$1.P$11
  Bottom 0.2: v81.6,12.6 82.2,13.2 87.8,13.2 88.8,12.2 90.8,12.2 91.6,13 91.6,13.4 v91.4,13.6
DB5  (via drill 0.4)
  Top 0.2: v80.8,13.4 80.4,13 41.2,13 39.2,11 31.4,11 v31,11.4 | IC3.60 90.71,14.91 90.4,14.6 v90.4,13.2 | 26.8,11.2 v27,11 27,11.6 24.9,13.7 24.8,13.8 24.8,38.2 26.78,40.18 U$1.P$12
  Bottom 0.2: v90.4,13.2 89.8,12.6 89,12.6 88,13.6 81,13.6 v80.8,13.4 | v27,11 30.6,11 v31,11.4
DB6  (via drill 0.4)
  Top 0.2: IC3.59 89.91,14.11 v89.2,13.4 | v79.8,14 79.2,13.4 40.8,13.4 38.8,11.4 32.4,11.4 v32,11.8 | v25.4,11.2 25,11.6 25,13 24.24,13.76 U$1.P$13
  Bottom 0.2: v79.8,14 80,14.2 81,14.2 81.2,14 88.6,14 v89.2,13.4 | v25.4,11.2 26,11.2 26.6,11.8 30.2,11.8 30.8,12.4 31.4,12.4 v32,11.8
DB7  (via drill 0.4)
  Top 0.2: IC3.58 89.11,14.71 v89,14.6 | v79,14.8 78,13.8 40.4,13.8 39,12.4 38.8,12.2 v37.4,12.2 | U$1.P$14 23.8,38.27 23.8,13 v24.2,12.6
  Bottom 0.2: v79,14.8 81,14.8 81.4,14.4 88.8,14.4 v89,14.6 | v24.2,12.6 30.4,12.6 30.6,12.8 36.8,12.8 v37.4,12.2
E  (via drill 0.4)
  Top 0.2: v51,51.6 51,50.8 49,48.8 49,43 47.6,41.6 43.25,41.6 U$1.P$6 | v78.8,50 80.2,50 v81.2,49 | IC3.8 91.15,23.85 91.1,23.9 v87.8,23.9
  Bottom 0.2: v51,51.6 52,52.6 52.6,52.6 53.2,52 78.6,52 79,51.6 79,50.2 v78.8,50 | v81.2,49 83,47.2 83,43.1 87.2,38.9 87.2,24.5 v87.8,23.9 87.5,24.2
GND  (via drill 0.4, 0.6)
  Top 0.2: 93.4,15.5 93.1,15.8 IC3.63 | 93.4,15.5 93.7,15.2 94.3,15.2 95.1,16 95.8,16 96.6,15.2 99.5,15.2 99.8,14.9 99.8,13.8 100.6,13 103,13 103.7,13.7 103.7,14.29 REST.1 | v93.4,13.8 93.4,15.5 | IC3.22 89.91,33.21 v90,33.3 | v88.6,34.7 88.6,35.98 C11.2
  Top 0.3: IC4.1 | IC4.1 61.99,19.8 61.7,20.1 | IC4.10 67.37,31.4 62.4,31.4 61.8,30.8 61.8,26.4 v62.4,25.8 62.4,20.8 61.7,20.1 | 61.7,20.1 59.65,18.05 C10.2 60,17.28 | 68.4,19.8 IC4.1 | U$1.P$1 54.72,43.06 T1.E | R1.A 48.35,32.25 50.2,30.4 50.2,29.2 C8.2 | v41.8,16.4 41.8,19.37 R11.2 41.19,20.02 U$3.7 | C6.- 33.33,35.45 34.41,35.48 | 34.41,35.48 C7.- | v21.6,22.6 21.6,25.8 v22.4,26.6 | v34.6,30.6 32.62,30.6 IC5.1 32.4,31.06 32.4,32.6 33.4,33.6 33.4,34.47 34.41,35.48 | IC4.1 67.54,17.06 68.8,15.8 77.6,15.8 v78,15.4 | C1.2 59.83,42.2 v60.2,41.83 60.37,41.83 61,41.2 61,40.6 61.48,40.12 U$4.16 | v78.4,56.4 v78.4,58.8 | U$4.22 78.47,46.47 v78.8,46.8 | IC3.53 85.11,12.69 86.2,11.6 86.2,11.24 JTAG.10 | C4.1 C26.1 98.68,42.42 v99.4,41.7 | C9.2 22.06,15.86 v21.4,15.2 | 91.61,65.29 C3.-
  Top 0.4: IC1.1 95.87,64.7 C2.- 91.61,65.29 | 90,77 v90,68.5 90,66.91 C3.- | 90,77 90,77.2 | J1.2 82.95,76.07 J1.3 87.93,79.07 90,77
  Bottom 0.2: v88.6,34.7 v90,33.3
  Bottom 0.3: JTAG.10 86.16,11.2 | v78,15.4 78,12.6 76.6,11.2 76,11.2 JTAG.2 76.05,11.15 77.4,9.8 84.76,9.8 JTAG.10 | 45.2,39 44.56,39.64 U$1.P$5 44.43,40.37 43,41.8 35.4,41.8 34.2,43 34.2,52.59 OK2.5 30.99,55.8 18.6,55.8 17.04,54.24 OK1.5 | 45.2,39 53.35,39 U$1.P$1 54.72,40.92 55.8,42 60.03,42 v60.2,41.83 | 45.2,34.17 45.2,39 | 45.2,34.17 R1.A | U$5.GND3 U$5.GND4 4.93,22.03 U$5.6 17.03,22.03 17.6,22.6 17.6,23.66 U$5.GND2 18.66,22.6 v21.6,22.6 | U$5.GND3 3.23,16.77 3.4,16.6 3.4,16.86 U$5.GND3 | 17.53,15.4 17.53,15.13 17,14.6 4.2,14.6 3.2,15.6 3.2,17 U$5.GND3 | 17.53,15.4 U$5.GND1 17.66,17 | v22.4,26.6 30.6,26.6 v34.6,30.6 38.17,34.17 45.2,34.17 | R1.A 44.05,32.25 42.8,31 42.8,17.4 v41.8,16.4 43,15.2 44,15.2 46.44,12.76 46.44,9.04 44.6,7.2 44.6,1.8 45.4,1 54.89,1 IOBOARD.2 | R1.A 47.12,28.88 49.6,26.4 61.8,26.4 v62.4,25.8 | OUT1.2 51.34,78.8 | 84.8,61.8 84.2,61.8 | JTAG.10 86.46,10.8 92.8,10.8 93.4,11.4 v93.4,13.8 | v78.4,58.8 78.4,59.2 81,61.8 84.8,61.8 | 84.8,61.8 85.6,61 85.6,44.8 85.6,41.4 88.5,38.5 88.5,37.6 | v78.8,46.8 79.6,47.6 79.6,55.2 v78.4,56.4 | v21.4,15.2 17.73,15.2 17.53,15.4 | v99.4,41.7 99.4,41.4 98.9,40.9 96.7,40.9 96.7,39.4 94.6,37.3 88.8,37.3 88.5,37.6 | 88.5,37.6 88.5,34.8 v88.6,34.7
  Bottom 0.4: 85.6,61 85.6,66.2 88,68.6 90,68.6
  other vias: 4,60.2 4,59 4,57.8 4,56.6 4,55.4 4,54.2 4,53 4,51.8 31.6,65 32.8,65 34,65 35.2,65 36.4,65 37.6,65 38.8,65 40,65 55.6,65 56.8,65 58,65 59.2,65 60.4,65 62.8,65 61.6,65 64,65 65.2,65 11.2,30.2 12.4,30.2 14.8,30.2 13.6,30.2 16,30.2 17.2,30.2 18.4,30.2 19.6,30.2 106,67.4 106,66.2 106,65 106,62.6 106,61.4 106,63.8 106,59 106,60.2 106,57.8 20.8,6.2 23.2,6.2 24.4,6.2 22,6.2 25.6,6.2 26.8,6.2 29.2,6.2 30.4,6.2 28,6.2 31.6,6.2 37.6,14.6 35.2,14.6 34,14.6 32.8,14.6 31.6,14.6 30.4,14.6 36.4,14.6 10,30.2 7.6,30.2 14.8,37.4 17.2,37.4 18.4,37.4 16,37.4 19.6,37.4 32.8,57.8 34,57.8 36.4,57.8 35.2,57.8 37.6,57.8 38.8,57.8 40,57.8
  pour Top (rank 2): -0.73,84.09 -0.73,-1 105.95,-1 107.22,0.27 107.22,85.36 -0.73,85.36
  pour Bottom (rank 2): -0.73,85.36 -0.73,-1 107.22,-1 107.22,85.36
LED  (via drill 0.4)
  Top 0.2: R2.2 52.54,47.2 v57,47.2 | 95.66,21.4 IC3.5 95.66,21.5 93.3,21.5 93,21.8 86.5,21.8 v86.3,22
  Bottom 0.2: v57,47.2 62.2,47.2 62.8,47.8 62.8,49.4 63.4,50 68.6,50 69.6,49 69.6,47 70.6,46 79.4,46 79.8,45.6 79.8,44.4 80.6,43.6 80.6,41 85,36.6 85,23.8 86.3,22.5 v86.3,22
LED0  (via drill 0.4)
  Top 0.2: v94.4,22.3 95,22.3 95.2,22.4 95.56,22.4 IC3.6 | 61.6,3.8 v61.8,4 59.4,1.6 52.2,1.6 51.52,2.28 IOBOARD.6
  Bottom 0.2: v94.4,22.3 94,21.9 94,15.8 95.2,14.6 95.2,11 93.4,9.2 90.4,9.2 87.4,6.2 64,6.2 v61.8,4
LED1  (via drill 0.4)
  Top 0.2: IC3.7 95.66,23 95.5,23 95.3,23.2 93.8,23.2 v93.6,23 | v61.6,5.4 60.2,5.4 59,6.6 50.33,6.6 IOBOARD.7
  Bottom 0.2: v93.6,23 93.4,22.8 93.4,19.6 93.2,19.4 93.2,15.6 94.4,14.4 94.4,11.2 92.8,9.6 90.2,9.6 87.2,6.6 62.8,6.6 v61.6,5.4
MIDIIN  (via drill 0.4)
  Top 0.2: 95.76,19 IC3.2 95.66,19 94.8,19 94.6,18.8 94.6,17.6 95,17.2 v96.2,17.2 | OK1.6 12.1,51.6 9.4,51.6 8.25,50.45 R7.2 7.96,48.4 7.4,48.4 6.4,47.4 6.4,40 12.4,34 19.2,34 23.4,29.8 23.4,11.2 24.4,10.2 v40.2,10.2 | v43.8,10.2 44,10.4 54.6,10.4 56.4,8.6 73.8,8.6 75.8,6.6 87.8,6.6 92.4,11.2 93.5,11.2 v96.1,13.8
  Bottom 0.2: v40.2,10.2 v43.8,10.2 | v96.1,13.8 96.1,17.1 v96.2,17.2
MIDIN2  (via drill 0.4)
  Top 0.2: R10.2 29.2,48.83 29.2,50.4 30.5,51.7 OK2.6 33.85,50.4 47.8,50.4 v48,50.2 | IC3.27 85.91,37.69 v85.4,38.2 | v81,46.6 80.4,46.6 79.2,47.8 77.2,47.8 v77,48
  Bottom 0.2: v48,50.2 48.2,50 52.2,50 52.8,50.6 53,50.8 74.8,50.8 77,48.6 v77,48 | v85.4,38.2 84.6,38.2 81.4,41.4 81.4,46.2 v81,46.6
MIDIOUT  (via drill 0.4)
  Top 0.2: 56.02,56 R8.2 55.8,56.22 55.8,59.4 57.2,60.8 v75.2,60.8 | 84.2,55 84.2,55.2 | v77.8,60.8 79.2,60.8 79.8,60.2 79.8,57.6 80.6,56.8 82.4,56.8 84.2,55 | 84.2,55 84.2,48.2 86.8,45.8 v92.5,45.8 | IC3.3 95.76,19.8 96.4,19.8 97.1,19.1 97.1,16.6 97.6,16.1 100,16.1 100.6,15.5 105.6,15.5 106.5,16.4 106.5,27.5 105.6,28.4 105.8,28.6 105.8,45.2 104.8,46.2 94.7,46.2 v94.3,45.8
  Bottom 0.2: v75.2,60.8 v77.8,60.8 | v92.5,45.8 v94.3,45.8
MISO  (via drill 0.4)
  Top 0.2: U$3.10 44.51,23.91 v44,23.4 | v48.2,9.4 50.6,7 73,7 75,5 88.6,5 92.2,8.6 98.5,8.6 v100,10.1 | IC3.13 95.76,27.8 97.2,27.8 98.9,26.1 98.9,20.6 99.1,20.4 v99.1,19.3
  Bottom 0.2: 48.2,10.8 48.2,10.6 | 48.2,10.8 48.2,12.2 44,16.4 v44,23.4 | v48.2,9.4 48.2,10.8 | v100,10.1 100,10.8 98.4,12.2 98.4,18.6 v99.1,19.3
MOSI  (via drill 0.4)
  Top 0.2: U$3.12 47.35,26.45 48.4,25.4 48.4,19 47.2,17.8 v47.2,15.2 | IC3.12 95.76,27 97,27 98.5,25.5 98.5,23.4 98.3,23.2 v98.3,20 | v53,8.2 53.8,7.4 73.2,7.4 75.2,5.4 88.4,5.4 92,9 97.6,9 v98.7,10.1
  Bottom 0.2: v53,8.2 53,9.4 v47.2,15.2 | v98.7,10.1 98.7,10.9 97.6,12 97.6,18.5 98,18.9 98,19.7 v98.3,20
N$1
  Top 0.2: R4.1 44.21,43.6 D2.C
  Bottom 0.2: D2.C 45.56,43.56 46.2,44.2 46.2,65.4 50,69.2 59.52,69.2 IN2.4
N$2
  Top 0.2: U$1.P$3 49.64,37.35 R1.S
N$4
  Top 0.2: OK2.2 38.96,49.16 38.4,48.6 38.4,44.6 39.4,43.6 R4.2
N$5
  Top 0.2: T1.C 57.31,45.57 R3.1
N$6  (via drill 0.4)
  Top 0.2: OK2.3 42.23,51.7 D2.A 48.12,53.72 49.4,55 49.4,60.8 v50.4,61.8
  Bottom 0.2: v50.4,61.8 67.6,61.8 72.8,67 72.8,72.32 IN2.5
N$7
  Top 0.2: T1.B 51.31,43.37 R2.1
N$8
  Top 0.2: U$1.P$16 57.26,43.58 R3.2
N$9
  Top 0.4: J1.1 85.95,71.66 D1.A
N$10  (via drill 0.4)
  Top 0.2: R6.1 21.71,43.54 D10.C 25.14,43.54 26.2,44.6 26.2,56 v23.8,58.4 | v23.8,62 23.8,65.4 22,67.2 22,72.38 IN1.4
  Bottom 0.2: v23.8,58.4 v23.8,62
N$11
  Top 0.2: R9.1 13.52,59.52 14.6,60.6 40.8,60.6 42.4,62.2 42.4,72.4 OUT1.4
N$12
  Top 0.2: R8.1 53.99,56.41 52.6,57.8 52.6,72.44 OUT1.5
N$13
  Top 0.2: OK1.2 19.36,49.16 18.4,48.2 18.4,44.92 R6.2
N$20  (via drill 0.4)
  Top 0.3: OK1.3 18.1,51.7 17,52.8 17,56.6 v19.8,59.4
  Bottom 0.3: OK1.3 22.03,51.7 D10.A | v19.8,59.4 19.8,62.6 21.8,64.6 27.6,64.6 32,69 32,72.36 IN1.5
N$22  (via drill 0.4)
  Top 0.2: v13,17.2 13,16.6 13.4,16.2 20.4,16.2 v21.2,17 | U$3.2 41.27,27.8 41.8,27.8 41.6,27.6 37.2,27.6 35.4,25.8 35.4,22.6 35.8,22.2 35.8,21.8 36.4,21.2 36.4,20.4 v36.2,20.2
  Bottom 0.2: U$5.2 13.43,17.63 v13,17.2 | v21.2,17 33.8,17 36.2,19.4 v36.2,20.2
N$23  (via drill 0.4)
  Top 0.2: U$3.3 41.04,26.6 37.6,26.6 35.8,24.8 35.8,23 37.35,21.45 v37.45,21.45
  Bottom 0.2: U$5.3 24.73,18.73 28.2,22.2 31.4,22.2 | 31.4,22.2 31.8,21.8 | 31.4,22.2 33.2,20.4 34.9,20.4 35.5,21 37,21 v37.45,21.45
N$24  (via drill 0.4)
  Top 0.2: v36.8,23 37.4,23 37.6,23.2 37.6,24.4 38.4,25.2 41.17,25.2 U$3.4
  Bottom 0.2: U$5.5 25.53,20.93 28,23.4 36.4,23.4 v36.8,23
N$25  (via drill 0.4)
  Top 0.2: v39,24 41.1,24 U$3.5
  Bottom 0.2: U$5.7 14.07,23.13 13.4,23.8 13.4,24.6 14.2,25.4 18.4,25.4 19.8,24 v39,24
N$27
  Top 0.2: 89,32.16 IC3.23 89.2,32.14 89.2,33.5 90.1,34.4 95.8,34.4 97.3,35.9 C4.2 | Q2.1 101.12,37.88 100.8,38.2 97.4,38.2 C4.2 | C4.2 97.2,38.5
N$28
  Top 0.2: C26.2 97.18,44.2 | C26.2 100.27,44.32 Q2.2 | C26.2 97.28,44.3 | C26.2 97.22,44.4 96.4,44.4 95.9,43.9 95.9,35.5 95.2,34.8 89.8,34.8 88.31,33.31 IC3.24
OE  (via drill 0.4)
  Top 0.2: U$3.8 46.39,20.39 45.2,19.2 | 45.2,19.2 43.91,19.2 R11.1 | IC3.29 84.31,33.49 83.2,34.6 v79,34.6 | 45.2,19.2 45.8,18.6 45.8,14.8 46.4,14.2 72.2,14.2 v72.8,14.8
  Bottom 0.2: v79,34.6 77,32.6 77,17.4 76.4,16.8 73.8,16.8 72.8,15.8 v72.8,14.8
OUT  (via drill 0.4)
  Top 0.2: IC3.30 83.51,32.89 82.6,33.8 79.8,33.8 v79.6,33.6 | v70.8,10.8 70.6,10.8 70,11.4 59.6,11.4 58.6,10.4 v55.8,10.4
  Bottom 0.2: v79.6,33.6 79.2,33.6 77.4,31.8 77.4,17.2 76.6,16.4 74.6,16.4 73.8,15.6 73.8,13.8 v70.8,10.8 | IOBOARD.5 51.6,5.33 51.6,6.6 52,7 53.6,7 55.2,8.6 55.2,10.2 55.4,10.4 v55.8,10.4
POWERIN  (via drill 0.4, 0.6)
  Top 0.3: v64.6,2 62.6,2 62,2.6 v61.6,2.6 | v58.6,4 47.69,4 IOBOARD.9
  Top 0.4: D1.C 98.72,69.72 v100,68.6
  Bottom 0.3: v106.2,53.6 106.2,10 104.2,8 97.4,8 97,7.6 90.8,7.6 86,2.8 65.4,2.8 v64.6,2 | v61.6,2.6 60.4,2.6 59,4 v58.6,4
  Bottom 0.4: v106.2,53.6 104.8,55 104.8,67.4 103.6,68.6 v100,68.6
POWEROUT  (via drill 0.4, 0.6)
  Top 0.3: v61.4,1 48.15,1 IOBOARD.10
  Top 0.4: IC1.3 91.3,56.9 91.6,56.6 96.4,56.6 97.6,57.8 97.6,62.6 100,65 102.4,65 102.4,65.25 C2.+ 103.6,64.12 v103.6,57.8
  Bottom 0.3: v61.4,1 64.4,4 86.4,4 90.6,8.2 96.8,8.2 97.6,9 104,9 105.5,10.5 105.4,11.6 105.4,46.6
  Bottom 0.4: 105.4,46.6 105.4,52.4 103.6,54.2 v103.6,57.8
RD
  Top 0.2: IC3.34 80.06,29.4 78.4,29.4 77.8,30 77.8,35.2 78.4,35.8 82,35.8 82.4,36.2 82.4,50.8 82,51.2 77.6,51.2 77,50.6 77,49.6 76.4,49 U$4.24
RESET  (via drill 0.4)
  Top 0.2: IC3.20 | IC3.20 91.5,31.2 91.1,30.8 89.6,30.8 v89.2,30.4 | IC3.20 91.51,32.71 92.1,33.3 93.2,33.3 v93.4,33.5 | v91.9,36.3 93.32,36.3 R5.2
  Bottom 0.2: JTAG.6 81.15,11.15 82.8,12.8 87.6,12.8 88.6,11.8 91.2,11.8 91.7,12.3 | 91.7,12.3 91.4,12 | 91.7,12.3 92.4,13 92.4,14 91.1,15.3 89.2,15.3 88.6,15.9 88.6,24.3 88.3,24.6 88.3,27.9 89.2,28.8 v89.2,30.4 | v93.4,33.5 93.4,34.4 91.9,35.9 v91.9,36.3
REST0  (via drill 0.4)
  Top 0.2: 93.91,32.51 IC3.17 94.35,32.05 v94.9,32.6
  Bottom 0.2: 103.71,16.9 REST.3 102.53,18 100.6,18 100,18.6 99.9,22.5 95.6,26.8 94.9,26.8 93.2,28.5 93.2,30.2 93.7,30.7 93.7,32.7 94.2,33.2 94.5,33.2 94.9,32.8 v94.9,32.6
REST1
  Top 0.2: REST.4 101.27,17 101.1,17 102.2,18.1 104.3,18.1 105.4,19.2 105.4,25.3 104.5,26.2 101.4,26.2 101,26.6 101,27.5 98.25,30.25 IC3.16
  Bottom 0.2: REST.4 101.17,16.9
REST2
  Top 0.2: 103.7,19.4 REST.5 102.4,20.67 102.4,25.3 101.9,25.8 101,25.8 100.6,26.2 100.6,27.3 98.45,29.45 IC3.15
REST3
  Top 0.2: IC3.14 96.95,28.65 99.4,26.2 99.4,21.13 REST.6
REST5  (via drill 0.4)
  Top 0.2: IC3.28 85.11,30.99 87.3,28.8 v94.1,28.8
  Bottom 0.2: v94.1,28.8 94.1,28.3 94.6,27.8 95.4,27.8 99.9,23.3 102.31,23.3 REST.7
REST6  (via drill 0.4)
  Top 0.2: IC3.26 86.71,31.19 88.7,29.2 93.5,29.2 v94.2,29.9 | v98.1,28.6 100,26.7 100,23.07 REST.8
  Bottom 0.2: v94.2,29.9 96.8,29.9 v98.1,28.6
REST7  (via drill 0.4)
  Top 0.2: IC3.25 87.51,31.09 89,29.6 92.6,29.6 93.8,30.8 94.3,30.8 95.1,31.6 96.2,31.6 v96.4,31.4
  Bottom 0.2: 103.7,24.51 REST.9 103.67,24.93 102.87,24.93 102,25.8 99.6,25.8 98.9,26.5 98.9,29.7 98.7,29.9 97.9,29.9 v96.4,31.4
RS  (via drill 0.4)
  Top 0.2: U$1.P$4 47.17,40.37 49.4,42.6 49.4,48.6 v52.2,51.4 | v81,47.8 80,47.8 78.8,49 v77.6,49 | IC3.4 95.66,20.6 94.7,20.6 94.4,20.9 87.5,20.9 v87.3,21
  Bottom 0.2: v52.2,51.4 75,51.4 75.5,50.9 | 75.5,50.9 76,50.4 | v81,47.8 81.2,48 81.4,48 82.6,46.8 82.6,42.8 86.8,38.6 86.8,22.5 87.3,22 v87.3,21 | v77.6,49 77.4,49 75.5,50.9
SCK  (via drill 0.4)
  Top 0.2: v51.8,9 53.4,9 54.6,7.8 73.4,7.8 75.4,5.8 88.2,5.8 91.8,9.4 96.9,9.4 97.3,9.8 97.3,10.5 99,12.2 v100,12.2 | U$3.11 44.42,25.18 v44,25.6 | v99.6,17.5 98.1,17.5 97.5,18.1 97.5,23.3 98,23.8 98,25.2 97,26.2 95.76,26.2 IC3.11
  Bottom 0.2: v51.8,9 50.8,9 49.4,10.4 49.4,11.6 45.2,15.8 45.2,23.8 44,25 v44,25.6 | v100,12.2 100,17.1 v99.6,17.5
SH  (via drill 0.4)
  Top 0.2: IC3.31 82.71,33.09 82.4,33.4 81.6,33.4 81,32.8 v80.4,32.8 | v72.6,11.4 72.4,11.4 72,11.8 58.6,11.8 v58,11.2
  Bottom 0.2: 78.1,31.9 77.8,31.6 77.8,17 76.8,16 75,16 74.4,15.4 74.4,13.2 v72.6,11.4 | 78.1,31.9 78.6,32.4 | v80.4,32.8 79,32.8 78.1,31.9 | IOBOARD.4 55.4,4.05 55.4,6 56.8,7.4 57.6,8.2 57.6,10.8 v58,11.2
TCK
  Top 0.2: IC3.57 88.4,16.36 88.4,15.4 88,15 88,13 89.4,11.6 89.4,9.4 87,7 77,7 75.95,8.05 JTAG.1
TDI
  Top 0.2: IC3.54 85.91,12.89 86.4,12.4 86.8,12.4 87.4,11.8 87.4,9.9 JTAG.9
TDO
  Top 0.2: IC3.55 86.71,13.09 87.8,12 87.8,8.4 86.8,7.4 79.2,7.4 78.6,8 78.6,8.5 JTAG.3
TMS  (via drill 0.4)
  Top 0.2: 87.6,16.36 IC3.56 87.51,12.89 88.6,11.8 v88.6,9.8
  Bottom 0.2: JTAG.5 81.03,8.17 81.8,7.4 87.4,7.4 88.6,8.6 v88.6,9.8
VCC  (via drill 0.4, 0.6)
  Top 0.2: IC3.64 94.06,16.3 | IC3.64 93.91,17.79 93.5,18.2 92.6,18.2 92.2,17.8 | REST.2 101.13,14.37 99.8,15.7 96.7,15.7 95.9,16.5 93.96,16.5 IC3.64 | R5.1 88.53,38.07 C11.1 89.09,38.01 v90.7,36.4 | v91.3,33.6 90.7,33.1 IC3.21
  Top 0.3: 57.48,16.9 IC4.20 56,19.8 51.4,24.4 51.4,27.4 | 57.48,16.9 C10.1 | 92.4,16.54 IC3.62 92.2,16.56 92.2,17.8 91.8,18.2 84.8,18.2 84.31,17.71 IC3.52 84.31,12.29 84.8,11.8 84.8,8.8 84.6,8.6 JTAG.7 82.18,10 79.8,10 78.65,11.15 JTAG.4 78.49,10.69 77.6,9.8 58.6,9.8 v58.4,9.6 | IC3.21 90.6,32.16 | 52.6,39 52.2,39.4 52.2,40.35 U$1.P$2 | 51.4,27.4 52.2,28.2 R1.E 52.2,38.6 52.6,39 | 51.4,27.4 50.3,27.4 C8.1 49.96,27.4 49.2,27.4 47.61,28.99 U$3.14 44.61,28.99 44.4,29.2 44.4,35.4 42.2,37.6 31.6,37.6 30.6,38.6 | IC5.3 27.8,31.03 27.8,33.2 27.8,33.8 C6.+ 27.45,35.45 30.6,38.6 | 57.48,16.9 57.48,15.72 v58.2,15 | R7.1 8.41,46.62 OK1.8 v15.42,49.84 R9.2 | R10.1 29.41,46.62 OK2.8 30.6,44.67 30.6,38.6 | 75.3,59.2 U$4.32 74.22,60.2 60.4,60.2 59.83,59.63 C1.1 59.8,52.2 58.8,52.2 58.4,51.8 58.4,49 59,48.4 59,41.4 59.8,40.6 U$1.P$15 58.43,39 52.6,39 | 75.83,56.62 75.8,56.6 75.28,56.6 U$4.30 | C3.+ 86.78,65.43 | 93.6,58.81 IC1.2 | v92.8,48.2 93.4,47.6 93.4,45.3 93.9,44.8 94.7,44.8 95.3,44.2 95.3,39.3 94.07,38.07 R5.1
  Top 0.4: 77.2,58.6 77.2,57 76.83,56.62 75.83,56.62 | 77.2,58.6 76.6,59.2 75.3,59.2 | 77.2,58.6 77.2,59.8 76.4,60.6 76.4,65 77.4,66 86.21,66 C3.+ 87.68,65.32 v89.2,63.8 | 93.6,58.81 93.6,60.6 92.8,61.4 v92.8,62.6
  Top 0.406: v97.6,53 97.1,52.5
  Bottom 0.2: v90.7,36.4 90.7,36.3 91.9,35.1 91.9,34.2 v91.3,33.6
  Bottom 0.3: OK2.8 25.38,46.62 24,48 17.26,48 v15.42,49.84 | IOBOARD.1 58.4,7.05 v58.4,9.6 60.2,11.4 60.2,13.6 58.8,15 v58.2,15
  Bottom 0.4: v97.6,53 97.6,54.2 96.4,55.4 95.2,55.4 94,56.6 94,61.4 v92.8,62.6 91.6,63.8 v89.2,63.8
  other vias: 88,55.4 88,54.2 88,53 88,51.8 88,50.6 89.2,49.4 94,48.2 95.2,48.2 96.4,48.2 97.6,49.4 97.6,50.6
  pour Top: 89.2,56.6 89.2,62.6 88,62.6 86.8,63.8 84.4,63.8 83.2,65 77.2,65 77.2,62.6 78.4,62.6 80.8,60.2 80.8,57.8 83.2,57.8 84.9,56 84.9,48.7 85.5,48 86.8,47 89.2,47 94.9,46.9 96.2,47 106,47 106,51.8 103.6,54.2 103.6,55.4 102.4,56.6 102.4,63.8 100,63.8 98.8,62.6 98.8,55.4 90.4,55.4
  pour Bottom: 86.8,59 86.8,46.9 87.9,47 96.4,47 98.8,48.2 104.8,48.2 104.8,51.8 103.6,53 102.5,54 102.5,57.5 102.4,59 103.6,60.2 103.6,65 102.4,66.2 95.2,66.2 89.2,60.2 88,60.2
VCC/2  (via drill 0.4)
  Top 0.2: 35.4,29 34.4,28 34.4,27.8 34.2,28 | 35.4,29 U$3.1 | IC5.2 30,29 30.8,28.2 34,28.2 34.2,28 | 35.4,29 39,32.6 39,35.49 C7.+ | v34.8,22.2 34.8,26.1 | 34.8,26.1 34.8,27.4 34.2,28 | 34,25.4 34.1,25.4 34.8,26.1
  Top 0.3: C9.1 13.65,20.65 v12.8,19.8
  Top 0.4: 34,25.4 30.78,25.4 IC5.4
  Bottom 0.2: v12.8,19.8 15.5,19.8 U$5.4 25.03,19.83 28.2,23 33.6,23 34.4,22.2 v34.8,22.2
  pour Top: 25.6,27.8 25.6,14.6 26.8,13.4 38.8,13.4 40,14.6 40,18.2 38.8,19.4 34,19.4 34,26.6 32.8,27.8
WR
  Top 0.2: IC3.33 78.55,30.25 78.2,30.6 78.2,35 78.6,35.4 82.2,35.4 82.8,36 82.8,54.6 82,55.4 75.31,55.4 U$4.29

### Text on the board
Top: top
Bottom: bottom
Document: rw-mini-cpu-1.5